# EAGLE design mikroPAD (EAGLE 6.5.0)
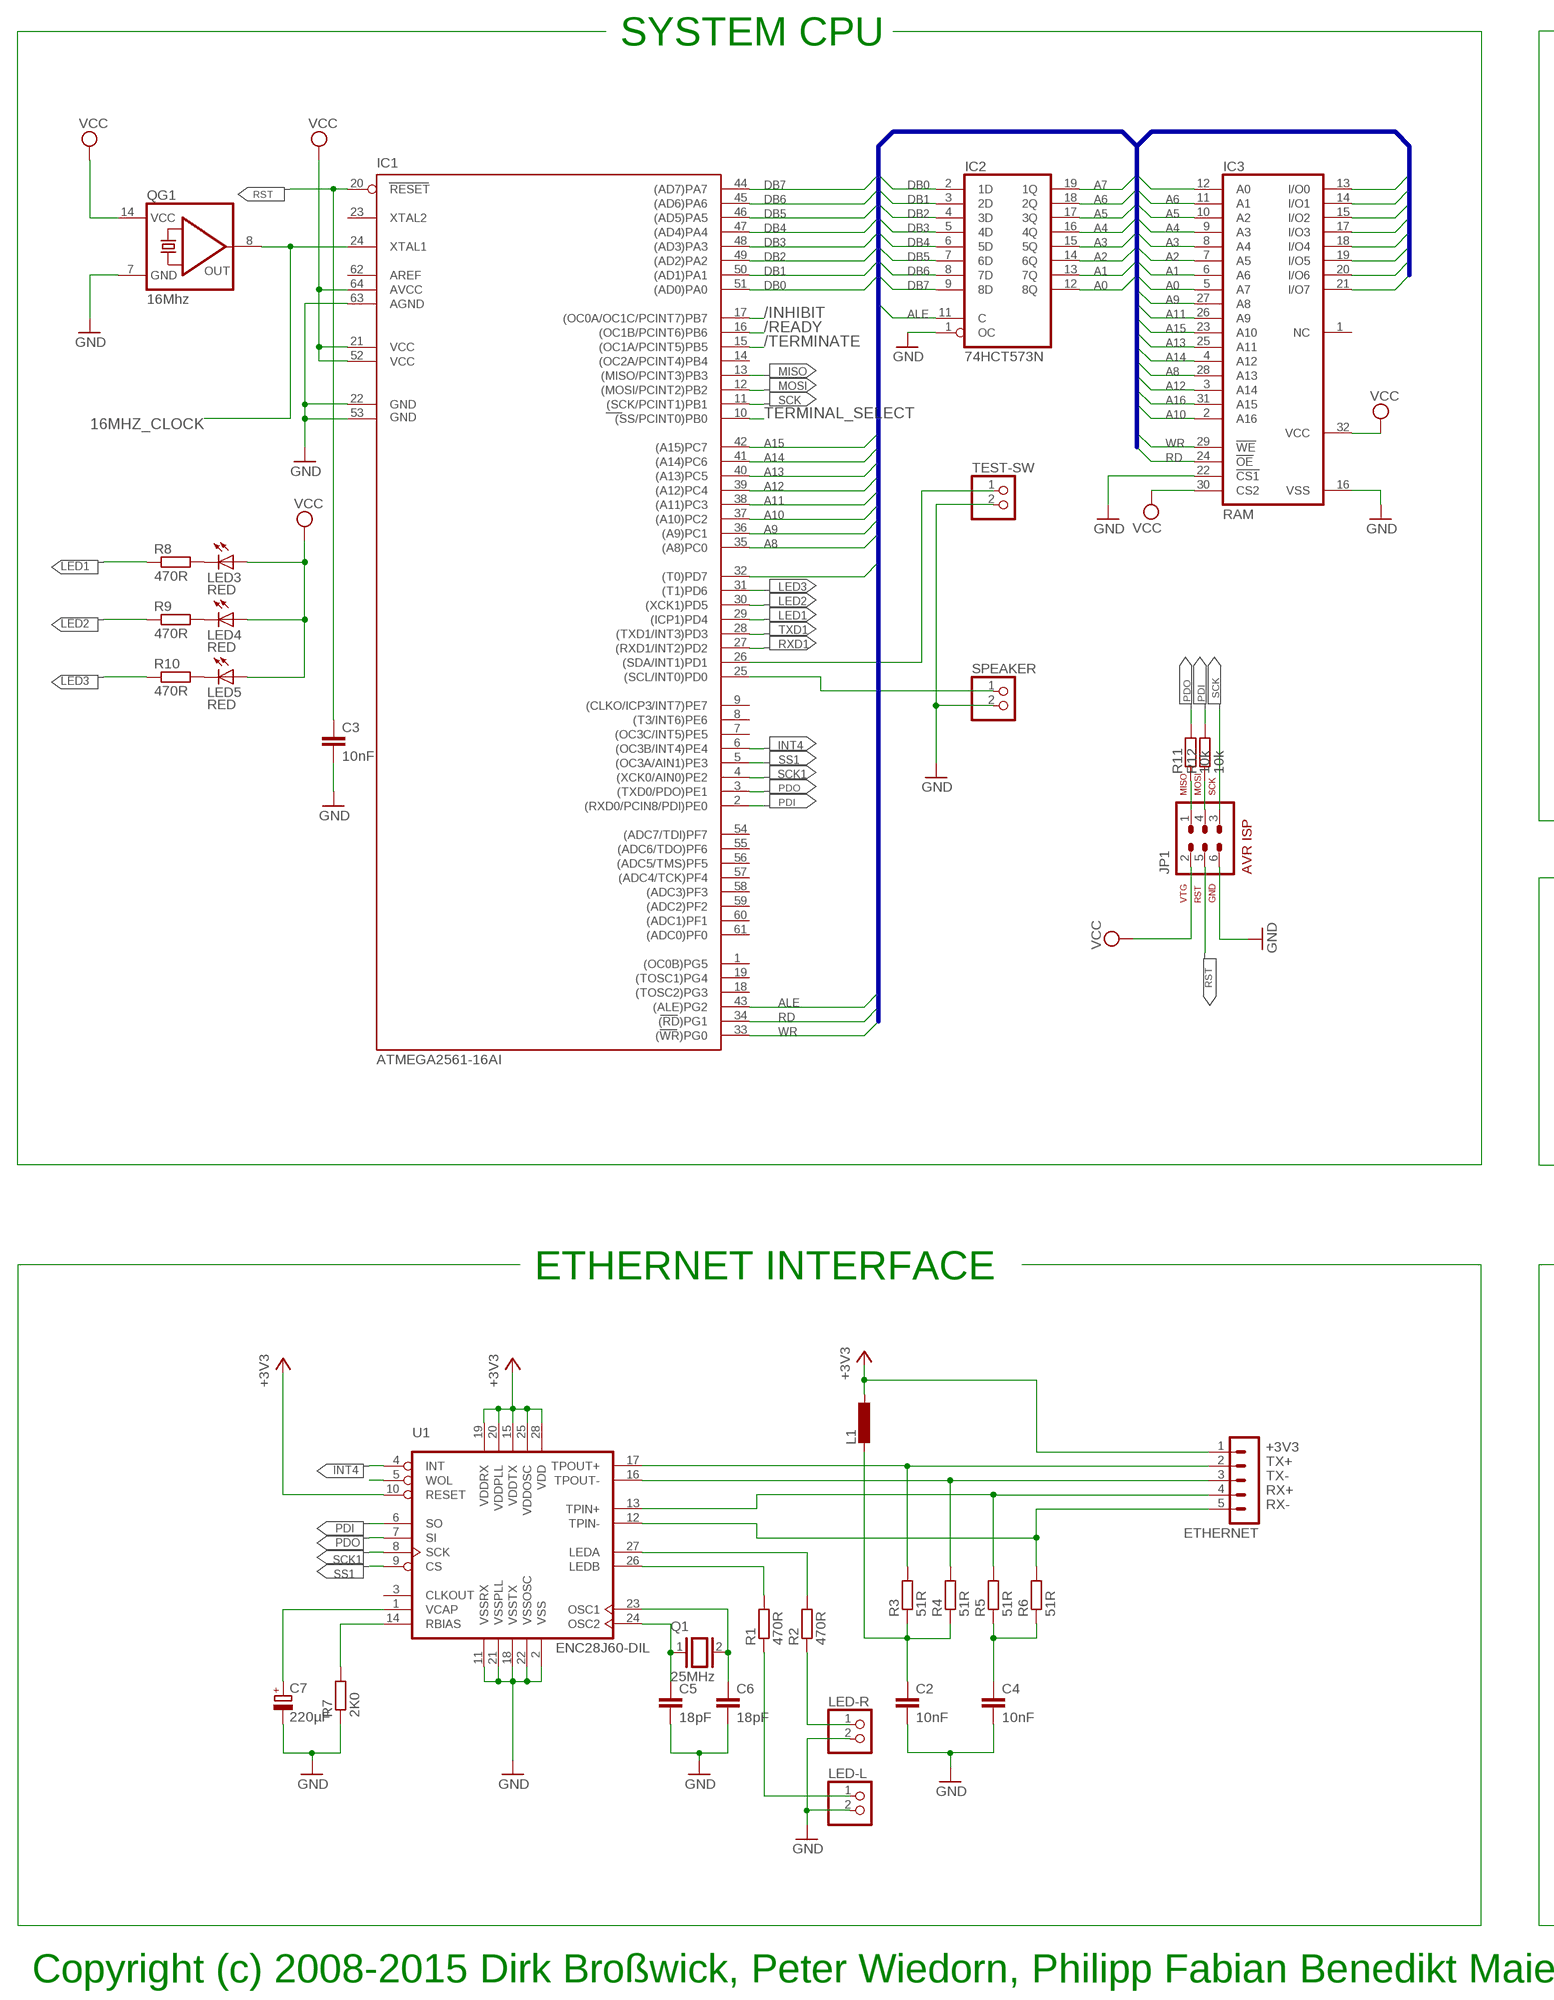
[diagram p0: schematic, sheet 1, part 1 of 2]
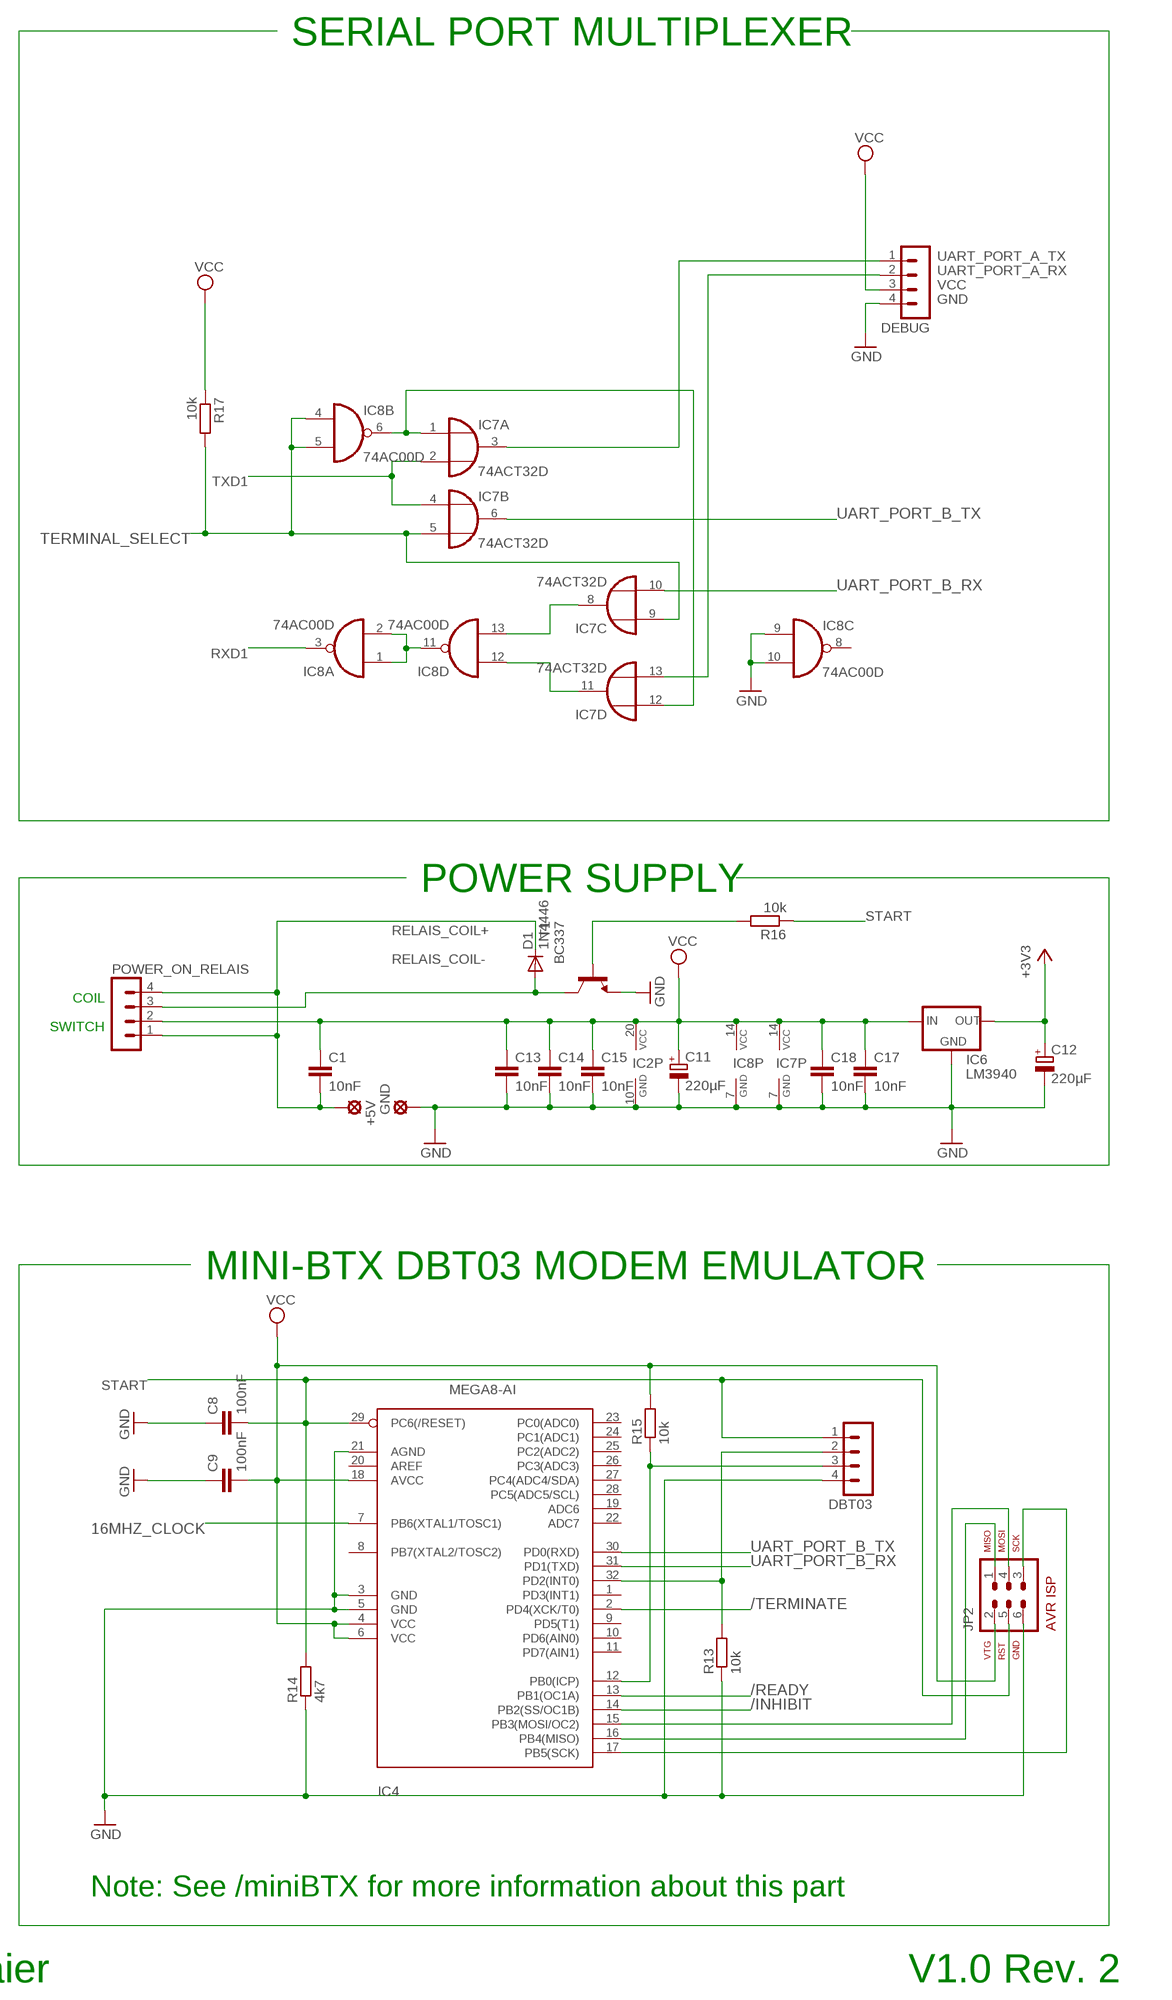
[diagram p1: schematic, sheet 1, part 2 of 2]

## Parts
+5V  SE14  [SE14]
C1  10nF  C-EU025-025X050  [C025-025X050]
C2  10nF  C-EU025-030X050  [C025-030X050]
C3  10nF  C-EU025-025X050  [C025-025X050]
C4  10nF  C-EU025-030X050  [C025-030X050]
C5  18pF  C-EU025-025X050  [C025-025X050]
C6  18pF  C-EU025-025X050  [C025-025X050]
C7  220µF  CPOL-EUE2-5  [E2-5]
C8  100nF  C-EU025-025X050  [C025-025X050]
C9  100nF  C-EU025-025X050  [C025-025X050]
C11  220µF  CPOL-EUE2.5-7  [E2,5-7]
C12  220µF  CPOL-EUE2.5-7  [E2,5-7]
C13  10nF  C-EU025-025X050  [C025-025X050]
C14  10nF  C-EU025-025X050  [C025-025X050]
C15  10nF  C-EU025-025X050  [C025-025X050]
C17  10nF  C-EU025-025X050  [C025-025X050]
C18  10nF  C-EU025-025X050  [C025-025X050]
D1  1N4446  [DO35-10]
DBT03  MA04-1  [MA04-1]
DEBUG  MA04-1  [MA04-1]
ETHERNET  MA05-1  [MA05-1]
GND  SE14  [SE14]
IC1  ATMEGA2561-16AI  ATMEGA1281-16AI  [TQFP64]
IC2  74HCT573N  [DIL20]
IC3  RAM  628128P  [DIL32]
IC4  MEGA8-AI  [TQFP32-08]
IC6  LM3940  78XXS  [78XXS]
IC7  74ACT32D  [SO14]
IC8  74AC00D  [SO14]
JP1  AVR-ISP-6  [AVR-ISP-6]
JP2  AVR-ISP-6  [AVR-ISP-6]
L1  L-EU0207/10  [0207/10]
LED3  RED  LED3MM  [LED3MM]
LED4  RED  LED3MM  [LED3MM]
LED5  RED  LED3MM  [LED3MM]
LED-L  PINHD-1X2  [1X02]
LED-R  PINHD-1X2  [1X02]
POWER_ON_RELAIS  MA04-1  [MA04-1]
Q1  25MHz  XTAL/S  [QS]
QG1  16Mhz  QG5860  [DIL14S]
R1  470R  R-EU_0207/10  [0207/10]
R2  470R  R-EU_0207/10  [0207/10]
R3  51R  R-EU_0207/10  [0207/10]
R4  51R  R-EU_0207/10  [0207/10]
R5  51R  R-EU_0207/10  [0207/10]
R6  51R  R-EU_0207/10  [0207/10]
R7  2K0  R-EU_0207/10  [0207/10]
R8  470R  R-EU_0207/10  [0207/10]
R9  470R  R-EU_0207/10  [0207/10]
R10  470R  R-EU_0207/10  [0207/10]
R11  10k  R-EU_0204/5  [0204/5]
R12  10k  R-EU_0204/5  [0204/5]
R13  10k  R-EU_0204/5  [0204/5]
R14  4k7  R-EU_0204/5  [0204/5]
R15  10k  R-EU_0204/5  [0204/5]
R16  10k  R-EU_0207/12  [0207/12]
R17  10k  R-EU_0204/7  [0204/7]
SPEAKER  PINHD-1X2  [1X02]
T1  BC337  [TO92]
TEST-SW  PINHD-1X2  [1X02]
U1  ENC28J60-DIL  [DIL28-3]

## Nets
16MHZ_CLOCK: IC1.24(XTAL1) IC4.7(PB6(XTAL1/TOSC1)) QG1.8(OUT)
+3V3 [power]: C12.+ ETHERNET.1 IC6.OUT L1.1 U1.10(RESET) U1.15(VDDTX) U1.19(VDDRX) U1.20(VDDPLL) U1.25(VDDOSC) U1.28(VDD)
/INHIBIT: IC1.17((OC0A/OC1C/PCINT7)PB7) IC4.14(PB2(SS/OC1B))
/READY: IC1.16((OC1B/PCINT6)PB6) IC4.13(PB1(OC1A))
/TERMINATE: IC1.15((OC1A/PCINT5)PB5) IC4.2(PD4(XCK/T0))
A0: IC2.12(8Q) IC3.5(A7)
A1: IC2.13(7Q) IC3.6(A6)
A2: IC2.14(6Q) IC3.7(A5)
A3: IC2.15(5Q) IC3.8(A4)
A4: IC2.16(4Q) IC3.9(A3)
A5: IC2.17(3Q) IC3.10(A2)
A6: IC2.18(2Q) IC3.11(A1)
A7: IC2.19(1Q) IC3.12(A0)
A8: IC1.35((A8)PC0) IC3.28(A13)
A9: IC1.36((A9)PC1) IC3.27(A8)
A10: IC1.37((A10)PC2) IC3.2(A16)
A11: IC1.38((A11)PC3) IC3.26(A9)
A12: IC1.39((A12)PC4) IC3.3(A14)
A13: IC1.40((A13)PC5) IC3.25(A11)
A14: IC1.41((A14)PC6) IC3.4(A12)
A15: IC1.42((A15)PC7) IC3.23(A10)
A16: IC1.32((T0)PD7) IC3.31(A15)
ALE: IC1.43((ALE)PG2) IC2.11(C)
DB0: IC1.51((AD0)PA0) IC2.2(1D) IC3.15(I/O2)
DB1: IC1.50((AD1)PA1) IC2.3(2D) IC3.14(I/O1)
DB2: IC1.49((AD2)PA2) IC2.4(3D) IC3.13(I/O0)
DB3: IC1.48((AD3)PA3) IC2.5(4D) IC3.17(I/O3)
DB4: IC1.47((AD4)PA4) IC2.6(5D) IC3.18(I/O4)
DB5: IC1.46((AD5)PA5) IC2.7(6D) IC3.19(I/O5)
DB6: IC1.45((AD6)PA6) IC2.8(7D) IC3.20(I/O6)
DB7: IC1.44((AD7)PA7) IC2.9(8D) IC3.21(I/O7)
DBT03_RX: DBT03.2 IC4.32(PD2(INT0)) R13.2
DBT03_TX: DBT03.3 IC4.12(PB0(ICP)) R15.1
GND [power]: C2.2 C3.2 C4.2 C5.2 C6.2 C7.- C8.1 C9.1 C11.- C12.- C13.2 C14.2 C15.2 C17.2 C18.2 DBT03.4 DEBUG.4 GND.MP IC1.22(GND) IC1.53(GND1) IC1.63(AGND) IC2.1(OC) IC2.10(GND) IC3.16(VSS) IC3.22(!CS1) IC4.3(GND) IC4.5(GND) IC4.21(AGND) IC6.GND IC7.7(P:GND) IC8.7(P:GND) IC8.9(C:I0) IC8.10(C:I1) JP1.6 JP2.6 LED-L.2 LED-R.2 QG1.7(GND) R7.1 R13.1 R14.1 SPEAKER.2 T1.1(E) TEST-SW.2 U1.2(VSS) U1.11(VSSRX) U1.18(VSSTX) U1.21(VSSPLL) U1.22(VSSOSC)
INT4: IC1.6((OC3B/INT4)PE4) U1.4(INT)
LED1: IC1.29((ICP1)PD4) R8.1
LED2: IC1.30((XCK1)PD5) R9.1
LED3: IC1.31((T1)PD6) R10.1
LEDA: R2.2 U1.27(LEDA)
LEDA_: LED-R.1 R2.1
LEDB: R1.2 U1.26(LEDB)
LEDB_: LED-L.1 R1.1
MISO: IC1.13((MISO/PCINT3)PB3)
MOSI: IC1.12((MOSI/PCINT2)PB2)
N$2: LED3.K(C) R8.2
N$3: LED4.K(C) R9.2
N$4: LED5.K(C) R10.2
N$8: R16.2 T1.2(B)
N$11: C5.1 Q1.1 U1.24(OSC2)
N$12: C4.1 R5.1 R6.1
N$13: C2.1 L1.2 R3.1 R4.1
N$14: C6.1 Q1.2 U1.23(OSC1)
N$17: R7.2 U1.14(RBIAS)
N$18: C7.+ U1.1(VCAP)
N$31: IC8.1(A:I0) IC8.2(A:I1) IC8.11(D:O)
N$32: JP1.1 R11.1
N$33: JP1.4 R12.1
N$35: IC7.8(C:O) IC8.13(D:I1)
N$38: IC7.1(A:I0) IC7.12(D:I0) IC8.6(B:O)
N$39: IC7.11(D:O) IC8.12(D:I0)
N$44: IC4.17(PB5(SCK)) JP2.3
N$45: IC4.15(PB3(MOSI/OC2)) JP2.4
N$46: IC4.16(PB4(MISO)) JP2.1
OC2A: IC1.26((SDA/INT1)PD1) TEST-SW.1
PDI: IC1.2((RXD0/PCIN8/PDI)PE0) R12.2 U1.6(SO)
PDO: IC1.3((TXD0/PDO)PE1) R11.2 U1.7(SI)
RD: IC1.34((RD)PG1) IC3.24(!OE)
RELAIS_COIL+: +5V.MP C1.2 D1.C POWER_ON_RELAIS.1 POWER_ON_RELAIS.4
RELAIS_COIL-: D1.A POWER_ON_RELAIS.3 T1.3(C)
RST: C3.1 IC1.20(RESET) JP1.5
RX+: ETHERNET.4 R5.2 U1.13(TPIN+)
RX-: ETHERNET.5 R6.2 U1.12(TPIN-)
RXD1: IC1.27((RXD1/INT2)PD2) IC8.3(A:O)
SCK: IC1.11((SCK/PCINT1)PB1) JP1.3
SCK1: IC1.4((XCK0/AIN0)PE2) U1.8(SCK)
SPEAKER: IC1.25((SCL/INT0)PD0) SPEAKER.1
SS1: IC1.5((OC3A/AIN1)PE3) U1.9(CS)
START: C8.2 DBT03.1 IC4.29(PC6(/RESET)) JP2.5 R14.2 R16.1
TERMINAL_SELECT: IC1.10((SS/PCINT0)PB0) IC7.5(B:I1) IC7.9(C:I0) IC8.4(B:I0) IC8.5(B:I1) R17.2
TX+: ETHERNET.2 R3.2 U1.17(TPOUT+)
TX-: ETHERNET.3 R4.2 U1.16(TPOUT-)
TXD1: IC1.28((TXD1/INT3)PD3) IC7.2(A:I1) IC7.4(B:I0)
UART_PORT_A_RX: DEBUG.2 IC7.13(D:I1)
UART_PORT_A_TX: DEBUG.1 IC7.3(A:O)
UART_PORT_B_RX: IC4.31(PD1(TXD)) IC7.10(C:I1)
UART_PORT_B_TX: IC4.30(PD0(RXD)) IC7.6(B:O)
VCC [power]: C1.1 C9.2 C11.+ C13.1 C14.1 C15.1 C17.1 C18.1 DEBUG.3 IC1.21(VCC) IC1.52(VCC1) IC1.64(AVCC) IC2.20(VCC) IC3.30(CS2) IC3.32(VCC) IC4.4(VCC) IC4.6(VCC) IC4.18(AVCC) IC6.IN IC7.14(P:VCC) IC8.14(P:VCC) JP1.2 JP2.2 LED3.A LED4.A LED5.A POWER_ON_RELAIS.2 QG1.14(VCC) R15.2 R17.1
WOL: U1.5(WOL)
WR: IC1.33((WR)PG0) IC3.29(!WE)
Unconnected: IC1.1((OC0B)PG5) IC1.7((OC3C/INT5)PE5) IC1.8((T3/INT6)PE6) IC1.9((CLKO/ICP3/INT7)PE7) IC1.14((OC2A/PCINT4)PB4) IC1.18((TOSC2)PG3) IC1.19((TOSC1)PG4) IC1.23(XTAL2) IC1.54((ADC7/TDI)PF7) IC1.55((ADC6/TDO)PF6) IC1.56((ADC5/TMS)PF5) IC1.57((ADC4/TCK)PF4) IC1.58((ADC3)PF3) IC1.59((ADC2)PF2) IC1.60((ADC1)PF1) IC1.61((ADC0)PF0) IC1.62(AREF) IC3.1(NC) IC4.1(PD3(INT1)) IC4.8(PB7(XTAL2/TOSC2)) IC4.9(PD5(T1)) IC4.10(PD6(AIN0)) IC4.11(PD7(AIN1)) IC4.19(ADC6) IC4.20(AREF) IC4.22(ADC7) IC4.23(PC0(ADC0)) IC4.24(PC1(ADC1)) IC4.25(PC2(ADC2)) IC4.26(PC3(ADC3)) IC4.27(PC4(ADC4/SDA)) IC4.28(PC5(ADC5/SCL)) IC8.8(C:O) U1.3(CLKOUT)

## Buses
DB[0..7],A[0..16],ALE,RD,WR

## Notes on the sheet
- SYSTEM CPU | SERIAL PORT MULTIPLEXER
- POWER SUPPLY
- COIL
- SWITCH
- ETHERNET INTERFACE | MINI-BTX DBT03 MODEM EMULATOR
- Note: See /miniBTX for more information about this part
- Copyright (c) 2008-2015 Dirk Broßwick, Peter Wiedorn, Philipp Fabian Benedikt Maier | V1.0 Rev. 2

## Library data of the parts
+5V GND = solpad:SE14: SOLDER PAD E1553, drill 1,4mm, distributor Buerklin, 07F820
C1-C6 C8 C9 C13-C15 C17 C18 = rcl:C-EU: CAPACITOR, European symbol
C7 C11 C12 = rcl:CPOL-EU: POLARIZED CAPACITOR, European symbol
D1 = diode:1N4446: DIODE high speed (Philips)
DBT03 DEBUG POWER_ON_RELAIS = con-lstb:MA04-1: PIN HEADER
ETHERNET = con-lstb:MA05-1: PIN HEADER
IC1 = atmel-2005:ATMEGA1281*: MICROCONTROLLER 128 Kbytes FLASH 4 Kbytes EEPROM 8 Kbytes SRAM 54 General Purpose I/O pins 6-channels 16-bit PWM 2 x Serial USARTs 8-channels 10-bit A/D
IC2 = 74xx-eu:74*573: 8-bit D latch BUS DRIVER
IC3 = memory-hitachi:628128P: MEMORY
IC4 = atmel:MEGA8: MICROCONTROLLER 8 Kbytes FLASH, 1 kbytes SRAM, 512 bytes EEPROM, USART, 6-channel 10 bit ADC, 2-channel 8 bit ADC Pin compatible with Atmega48, ATMega88, ATMega168 Source: avr.lbr
IC6 = v-reg:78XXS: VOLTAGE REGULATOR
IC7 = 74xx-eu:74*32: Quad 2-input OR gate
IC8 = 74xx-eu:74*00: Quad 2-input NAND gate
JP1 JP2 = atmel-1:AVR-ISP-6: AVR ISP-6 Serial Programming Header
L1 = rcl:L-EU: INDUCTOR, European symbol
LED3-LED5 = led:LED: LED OSRAM: - CHIPLED LG R971, LG N971, LY N971, LG Q971, LY Q971, LO R971, LY R971 LH N974, LH R974 LS Q976, LO Q976, LY Q976 LO Q996 - Hyper CHIPLED LW Q18S LB Q993, LB Q99A, LB R99A - SideLED LS A670, LO A670, LY A670, LG A670, LP A670 LB A673, LV A673, LT A673, LW A673 LH A674 LY A675 LS A676, LA A676, LO A676, LY A676, LW A676 LS A679, LY A679, LG A679 - Hyper Micro SIDELED® LS Y876, LA Y876, LO Y876, LY Y876 LT Y87S - SmartLED LW L88C, LW L88S LB L89C, LB L89S, LG L890 LS L89K, LO L89K, LY L89K LS L896, LA L896, LO L896, LY L896 - TOPLED LS T670, LO T670, LY T670, LG T670, LP T670 LSG T670, LSP T670, LSY T670, LOP T670, LYG T670 LG T671, LOG T671, LSG T671 LB T673, LV T673, LT T673, LW T673 LH T674 LS T676, LA T676, LO T676, LY T676, LB T676, LH T676, LSB T676, LW T676 LB T67C, LV T67C, LT T67C, LS T67K, LO T67K, LY T67K, LW E67C LS E67B, LA E67B, LO E67B, LY E67B, LB E67C, LV E67C, LT E67C LW T67C LS T679, LY T679, LG T679 LS T770, LO T770, LY T770, LG T770, LP T770 LB T773, LV T773, LT T773, LW T773 LH T774 LS E675, LA E675, LY E675, LS T675 LS T776, LA T776, LO T776, LY T776, LB T776 LHGB T686 LT T68C, LB T68C - Hyper Mini TOPLED® LB M676 - Mini TOPLED Santana® LG M470 LS M47K, LO M47K, LY M47K Source: http://www.osram.convergy.de LUXEON: - LUMILED® LXK2-PW12-R00, LXK2-PW12-S00, LXK2-PW14-U00, LXK2-PW14-V00 LXK2-PM12-R00, LXK2-PM12-S00, LXK2-PM14-U00 LXK2-PE12-Q00, LXK2-PE12-R00, LXK2-PE12-S00, LXK2-PE14-T00, LXK2-PE14-U00 LXK2-PB12-K00, LXK2-PB12-L00, LXK2-PB12-M00, LXK2-PB14-N00, LXK2-PB14-P00, LXK2-PB14-Q00 LXK2-PR12-L00, LXK2-PR12-M00, LXK2-PR14-Q00, LXK2-PR14-R00 LXK2-PD12-Q00, LXK2-PD12-R00, LXK2-PD12-S00 LXK2-PH12-R00, LXK2-PH12-S00 LXK2-PL12-P00, LXK2-PL12-Q00, LXK2-PL12-R00 Source: www.luxeon.com KINGBRIGHT: KA-3528ASYC Source: www.kingbright.com
LED-L LED-R SPEAKER TEST-SW = pinhead:PINHD-1X2: PIN HEADER
Q1 = special:XTAL/S: CRYSTAL
QG1 = crystal:QG5860: CRYSTAL RESONATOR
R1-R17 = rcl:R-EU_: RESISTOR, European symbol
T1 = transistor:BC337: NPN TRANSISTOR
U1 = microchip-enc28j60:ENC28J60-*: Microchip 10Mbit Eth. contoller with SPI interface

## Net classes
0 default: width 0.203 mm
1 power: width 0.356 mm

## Board
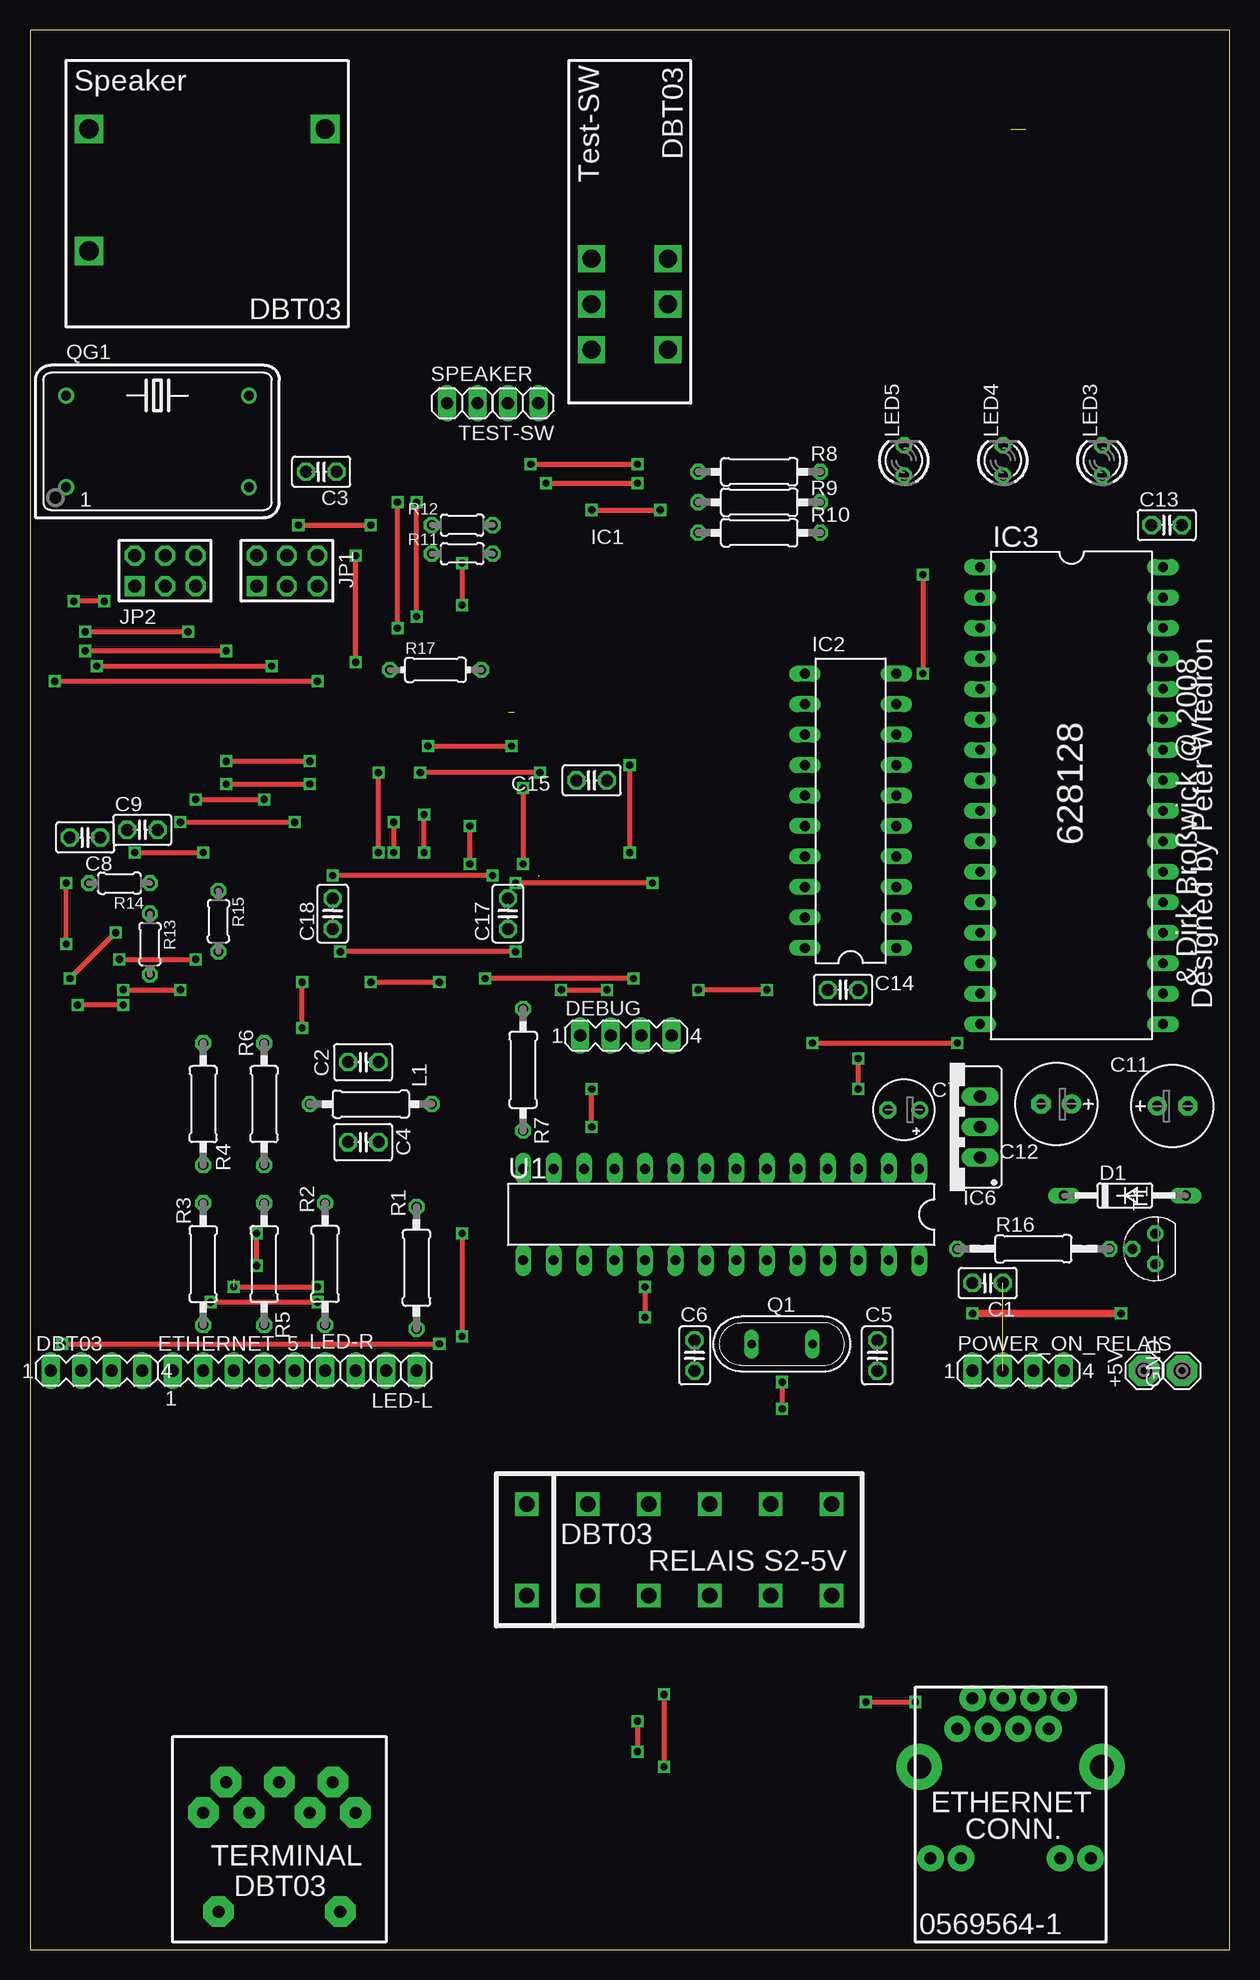
[diagram p2: board, top side]
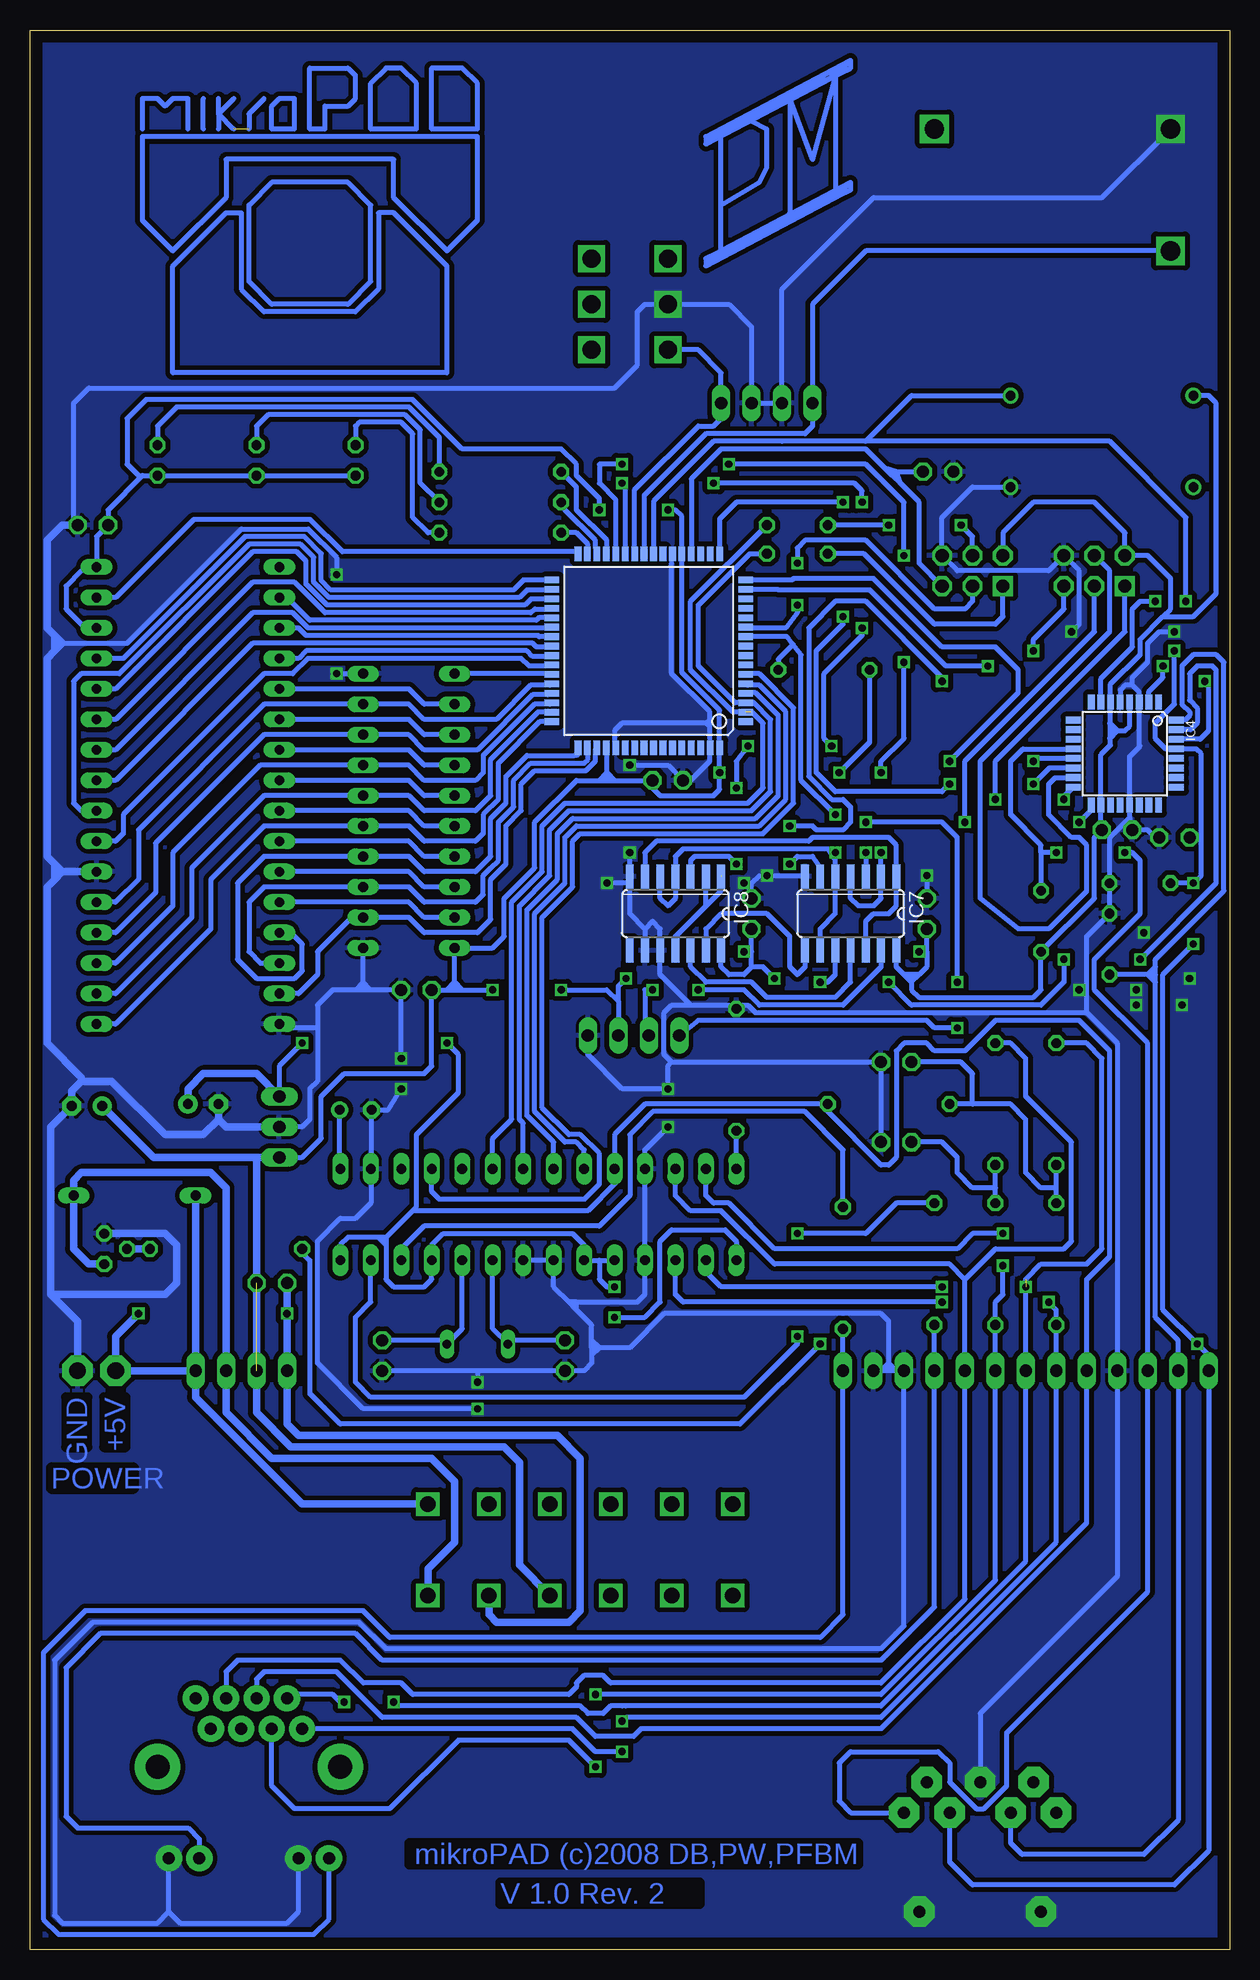
[diagram p3: board, bottom side, seen from below]

Size 100 x 160.01 mm. Coordinates in mm from the lower left corner, seen from the top.
Outline: 0,0 100,0 100,160.01 0,160.01 0,0
Copper layers (1*16): Top 0.035mm / dielectric 1.5mm / Bottom 0.035mm
Design rules "default": minimum track width 10mil, minimum drill 24mil, track to track 8mil, track to pad 8mil, pad to pad 8mil, via to via 8mil, smd to smd 8mil, copper to edge 40mil, drill to drill 8mil, minimum pad ring 10mil, minimum via ring 8mil, stop-mask expansion 4mil, vias tented up to drill 0mil, thermal gap 10mil

### Footprints (pad centres in the part's own frame; a part is rotated, then mirrored left to right if it is on the bottom)
SE14 = drill 1.397 pad 2.54 octagon: MP 0,0
C025-025X050 = drill 1 octagon: 1 -1.27,0; 2 1.27,0
C025-030X050 = drill 1 octagon: 1 -1.27,0; 2 1.27,0
E2-5 = drill 0.813 pad 1.422: + -1.333,0 | drill 0.813 pad 1.422 octagon: - 1.333,0
E2,5-7 = drill 0.813 pad 1.6: + -1.27,0 | drill 0.813 pad 1.6 octagon: - 1.27,0
DO35-10 = drill 0.813 long: A 5.08,0; C -5.08,0
MA04-1 = drill 1.016 long: 1 -3.81,0; 2 -1.27,0; 3 1.27,0; 4 3.81,0
MA05-1 = drill 1.016 long: 1 -5.08,0; 2 -2.54,0; 3 0,0; 4 2.54,0; 5 5.08,0
TQFP64 = smd 1.194 x 0.559: 1 -8.077,5.905; 2 -8.077,5.118; 3 -8.077,4.331; 4 -8.077,3.543; 5 -8.077,2.756; 6 -8.077,1.968; 7 -8.077,1.181; 8 -8.077,0.394; 9 -8.077,-0.394; 10 -8.077,-1.181; 11 -8.077,-1.968; 12 -8.077,-2.756; 13 -8.077,-3.543; 14 -8.077,-4.331; 15 -8.077,-5.118; 16 -8.077,-5.905; 33 8.077,-5.905; 34 8.077,-5.118; 35 8.077,-4.331; 36 8.077,-3.543; 37 8.077,-2.756; 38 8.077,-1.968; 39 8.077,-1.181; 40 8.077,-0.394; 41 8.077,0.394; 42 8.077,1.181; 43 8.077,1.968; 44 8.077,2.756; 45 8.077,3.543; 46 8.077,4.331; 47 8.077,5.118; 48 8.077,5.905 | smd 0.559 x 1.194: 17 -5.905,-8.077; 18 -5.118,-8.077; 19 -4.331,-8.077; 20 -3.543,-8.077; 21 -2.756,-8.077; 22 -1.968,-8.077; 23 -1.181,-8.077; 24 -0.394,-8.077; 25 0.394,-8.077; 26 1.181,-8.077; 27 1.968,-8.077; 28 2.756,-8.077; 29 3.543,-8.077; 30 4.331,-8.077; 31 5.118,-8.077; 32 5.905,-8.077; 49 5.905,8.077; 50 5.118,8.077; 51 4.331,8.077; 52 3.543,8.077; 53 2.756,8.077; 54 1.968,8.077; 55 1.181,8.077; 56 0.394,8.077; 57 -0.394,8.077; 58 -1.181,8.077; 59 -1.968,8.077; 60 -2.756,8.077; 61 -3.543,8.077; 62 -4.331,8.077; 63 -5.118,8.077; 64 -5.905,8.077
DIL20 = drill 0.813 long: 1 -11.43,-3.81; 2 -8.89,-3.81; 3 -6.35,-3.81; 4 -3.81,-3.81; 5 -1.27,-3.81; 6 1.27,-3.81; 7 3.81,-3.81; 8 6.35,-3.81; 9 8.89,-3.81; 10 11.43,-3.81; 11 11.43,3.81; 12 8.89,3.81; 13 6.35,3.81; 14 3.81,3.81; 15 1.27,3.81; 16 -1.27,3.81; 17 -3.81,3.81; 18 -6.35,3.81; 19 -8.89,3.81; 20 -11.43,3.81
DIL32 = drill 0.813 long: 1 -19.05,-7.62; 2 -16.51,-7.62; 3 -13.97,-7.62; 4 -11.43,-7.62; 5 -8.89,-7.62; 6 -6.35,-7.62; 7 -3.81,-7.62; 8 -1.27,-7.62; 9 1.27,-7.62; 10 3.81,-7.62; 11 6.35,-7.62; 12 8.89,-7.62; 13 11.43,-7.62; 14 13.97,-7.62; 15 16.51,-7.62; 16 19.05,-7.62; 17 19.05,7.62; 18 16.51,7.62; 19 13.97,7.62; 20 11.43,7.62; 21 8.89,7.62; 22 6.35,7.62; 23 3.81,7.62; 24 1.27,7.62; 25 -1.27,7.62; 26 -3.81,7.62; 27 -6.35,7.62; 28 -8.89,7.62; 29 -11.43,7.62; 30 -13.97,7.62; 31 -16.51,7.62; 32 -19.05,7.62
TQFP32-08 = smd 1.27 x 0.559: 1 -4.293,2.8; 2 -4.293,2; 3 -4.293,1.2; 4 -4.293,0.4; 5 -4.293,-0.4; 6 -4.293,-1.2; 7 -4.293,-2; 8 -4.293,-2.8; 17 4.293,-2.8; 18 4.293,-2; 19 4.293,-1.2; 20 4.293,-0.4; 21 4.293,0.4; 22 4.293,1.2; 23 4.293,2; 24 4.293,2.8 | smd 0.559 x 1.27: 9 -2.8,-4.293; 10 -2,-4.293; 11 -1.2,-4.293; 12 -0.4,-4.293; 13 0.4,-4.293; 14 1.2,-4.293; 15 2,-4.293; 16 2.8,-4.293; 25 2.8,4.293; 26 2,4.293; 27 1.2,4.293; 28 0.4,4.293; 29 -0.4,4.293; 30 -1.2,4.293; 31 -2,4.293; 32 -2.8,4.293
78XXS = drill 1.016 long: GND 0,-2.54; IN -2.54,-2.54; OUT 2.54,-2.54
SO14 = smd 0.66 x 2.032: 1 -3.81,-3.073; 2 -2.54,-3.073; 3 -1.27,-3.073; 4 0,-3.073; 5 1.27,-3.073; 6 2.54,-3.073; 7 3.81,-3.073; 8 3.81,3.073; 9 2.54,3.073; 10 1.27,3.073; 11 0,3.073; 12 -1.27,3.073; 13 -2.54,3.073; 14 -3.81,3.073
AVR-ISP-6 = drill 1.1 square: 1 -2.54,-1.27 | drill 1.1 octagon: 2 -2.54,1.27; 3 0,-1.27; 4 0,1.27; 5 2.54,-1.27; 6 2.54,1.27
0207/10 = drill 0.813 octagon: 1 -5.08,0; 2 5.08,0
LED3MM = drill 0.813 octagon: A -1.27,0; K 1.27,0
1X02 = drill 1.016 long: 1 -1.27,0; 2 1.27,0
QS = drill 0.7 long: 1 -2.54,0; 2 2.54,0
DIL14S = drill 0.813: 1 -7.62,-3.81; 7 7.62,-3.81; 8 7.62,3.81; 14 -7.62,3.81
0204/5 = drill 0.813 octagon: 1 -2.54,0; 2 2.54,0
0207/12 = drill 0.813 octagon: 1 -6.35,0; 2 6.35,0
0204/7 = drill 0.813 octagon: 1 -3.81,0; 2 3.81,0
TO92 = drill 0.813 octagon: 1 1.27,0; 2 0,1.905; 3 -1.27,0
DIL28-3 = drill 0.813 long: 1 -16.51,-3.81; 2 -13.97,-3.81; 3 -11.43,-3.81; 4 -8.89,-3.81; 5 -6.35,-3.81; 6 -3.81,-3.81; 7 -1.27,-3.81; 8 1.27,-3.81; 9 3.81,-3.81; 10 6.35,-3.81; 11 8.89,-3.81; 12 11.43,-3.81; 13 13.97,-3.81; 14 16.51,-3.81; 15 16.51,3.81; 16 13.97,3.81; 17 11.43,3.81; 18 8.89,3.81; 19 6.35,3.81; 20 3.81,3.81; 21 1.27,3.81; 22 -1.27,3.81; 23 -3.81,3.81; 24 -6.35,3.81; 25 -8.89,3.81; 26 -11.43,3.81; 27 -13.97,3.81; 28 -16.51,3.81

### Placement (x,y rotation side)
+5V  92.86,48.26 90 top
C1  79.84,55.56 180 top
C2  27.77,73.97 0 top
C3  24.28,123.19 180 top
C4  27.77,67.31 0 top
C5  70.64,49.53 270 top
C6  55.4,49.53 270 top
C7  72.86,70 180 top
C8  4.6,92.71 180 top
C9  9.36,93.34 0 top
C11  95.24,70.32 0 top
C12  85.56,70.48 180 top
C13  94.77,118.74 0 top
C14  67.78,80 0 top
C15  46.82,97.47 180 top
C17  39.84,86.36 90 top
C18  25.23,86.36 90 top
D1  91.28,62.86 0 top
DBT03  5.55,48.26 0 top
DEBUG  49.68,76.2 0 top
ETHERNET  16.98,48.26 0 top
GND  96.04,48.26 90 top
IC1  48.41,108.26 180 bottom
IC2  68.41,94.93 90 top
IC3  86.83,96.2 270 top
IC4  8.73,99.69 270 bottom
IC6  76.67,68.58 90 top
IC7  31.58,86.36 180 bottom
IC8  46.19,86.36 180 bottom
JP1  21.42,114.93 0 top
JP2  11.27,114.93 0 top
L1  28.41,70.48 180 top
LED3  89.37,124.14 90 top
LED4  81.11,124.14 90 top
LED5  72.86,124.14 90 top
LED-L  30.95,48.26 180 top
LED-R  25.87,48.26 0 top
POWER_ON_RELAIS  82.39,48.26 0 top
Q1  62.7,50.48 180 top
QG1  10.63,125.72 0 top
R1  32.22,56.83 90 top
R2  24.6,57.15 90 top
R3  14.44,57.15 270 top
R4  14.44,70.48 90 top
R5  19.52,57.15 270 top
R6  19.52,70.48 90 top
R7  41.11,73.34 270 top
R8  60.8,123.19 0 top
R9  60.8,120.65 0 top
R10  60.8,118.1 0 top
R11  36.03,116.36 0 top
R12  36.03,118.74 0 top
R13  10,83.81 270 top
R14  7.46,88.9 180 top
R15  15.71,85.72 270 top
R16  83.66,58.42 0 top
R17  33.81,106.68 0 top
SPEAKER  36.03,128.9 0 top
T1  93.81,58.42 90 top
TEST-SW  41.11,128.9 180 top
U1  57.62,61.27 180 top

### Tracks (layer width: path | path; a pad name or v marks a point on that pad's centre or on a via)
16MHZ_CLOCK  (via drill 0.6)
  Top 0.406: v6.18,112.39 v3.64,112.39
  Bottom 0.406: QG1.8 26.5,129.53 30.31,125.72 | 30.31,125.72 37.3,125.72 43.02,125.72 48.02,120.72 IC1.24 | 30.31,125.72 10,125.72 3.64,119.38 v3.64,112.39 | IC4.7 10.73,105.94 8.09,108.58 8.09,111.75 7.46,112.39 v6.18,112.39
+3V3  (via drill 0.6, 1 pad 2.18)
  Top 0.406: v51.27,55.24 v51.27,52.7 | v65.24,75.56 v77.3,75.56
  Bottom 0.406: U1.15 41.11,59.05 42.06,60 46.51,60 47.46,59.05 47.46,53.97 48.73,52.7 v51.27,52.7 | 52.54,57.46 U1.20 53.81,58.73 54.76,59.69 65.56,59.69 66.51,58.73 U1.25 66.51,55.88 67.14,55.24 69.69,55.24 70.32,55.88 70.32,58.73 | 52.54,57.46 U1.19 | 70.32,59.37 70.95,59.37 | 70.95,59.37 73.5,59.37 74.13,58.73 U1.28 | 70.32,59.37 70.32,58.73 | 68.1,61.59 53.49,61.59 51.27,63.81 U1.10 51.27,67.94 48.73,70.48 L1.1 33.49,69.84 29.04,65.4 28.41,65.4 27.77,66.03 27.77,74.93 27.14,75.56 25.23,75.56 24.6,74.93 22.06,74.93 19.52,77.47 12.54,77.47 10,74.93 10,57.78 11.9,55.88 ETHERNET.1 11.9,35.56 29.04,18.41 49.05,18.41 49.68,17.78 52.86,17.78 54.45,19.36 70.64,19.36 74.45,23.17 80.48,23.17 81.11,22.54 v81.11,20.95 | 68.1,61.59 70.32,59.37 | 70.95,59.37 70.32,58.73 | v51.27,55.24 51.91,55.24 52.54,55.88 52.54,57.46 | IC6.OUT 79.21,73.66 v77.3,75.56 | v65.24,75.56 64.29,74.61 64.29,71.43 67.78,67.94 67.78,61.91 68.1,61.59
  Bottom 0.61: C12.+ 86.83,71.75 85.56,73.02 81.11,73.02 IC6.OUT
/INHIBIT  (via drill 0.6)
  Top 0.406: v16.34,97.15 v23.33,97.15 | v32.22,111.12 v32.22,120.65
  Bottom 0.406: IC1.17 42.51,119.25 41.11,120.65 v32.22,120.65 | IC4.14 15.01,98.49 v16.34,97.15 | v32.22,111.12 32.22,110.48 34.44,108.26 34.44,98.1 32.85,96.52 23.96,96.52 v23.33,97.15
/READY  (via drill 0.6)
  Top 0.406: v16.34,99.06 v23.33,99.06
  Bottom 0.406: IC4.13 16.11,99.29 v16.34,99.06 | v23.33,99.06 17.61,104.77 17.61,106.68 19.52,108.58 23.96,108.58 29.68,114.3 36.35,114.3 36.48,114.17 IC1.16
/TERMINATE  (via drill 0.6)
  Top 0.406: v5.55,106.99 v20.15,106.99
  Bottom 0.406: IC4.2 6.72,104.87 5.55,106.04 v5.55,106.99 | v20.15,106.99 23.65,106.99 30,113.34 37.62,113.34 37.66,113.38 IC1.15
A0
  Bottom 0.406: IC2.12 67.14,103.82 68.41,105.09 IC3.5
A1
  Bottom 0.406: IC2.13 67.14,101.28 68.41,102.55 IC3.6
A2
  Bottom 0.406: IC2.14 67.14,98.74 68.41,100.01 IC3.7
A3
  Bottom 0.406: IC2.15 67.14,96.2 68.41,97.47 IC3.8
A4
  Bottom 0.406: IC2.16 67.14,93.66 68.41,94.93 IC3.9
A5
  Bottom 0.406: IC2.17 67.14,91.12 68.41,92.39 IC3.10
A6
  Bottom 0.406: IC2.18 67.14,88.58 68.41,89.85 IC3.11
A7
  Bottom 0.406: IC2.19 67.14,86.04 68.41,87.31 IC3.12
A8
  Bottom 0.254: 76.35,113.18
  Bottom 0.406: IC3.28 92.86,105.09 81.43,116.52 77.76,116.52 76.99,115.75 76.99,113.82 76.35,113.18 75.24,112.07 58.73,112.07 58.21,112.59 IC1.35
A9
  Bottom 0.254: 56.67,111.75 IC1.36
  Bottom 0.406: IC3.27 92.86,102.55 81.43,113.98 77.94,113.98 75.4,111.44 58.25,111.44 57.94,111.75 56.67,111.75
A10
  Bottom 0.406: IC3.2 78.58,112.71 76.67,110.8 57.78,110.8 57.56,111.02 IC1.37
A11
  Bottom 0.254: IC1.38 56.67,110.17
  Bottom 0.406: 56.67,110.17 76.83,110.17 78.1,111.44 81.43,111.44 92.86,100.01 IC3.26
A12
  Bottom 0.406: IC3.3 77.62,110.17 76.99,109.53 57.62,109.53 arc-90 57.53,109.44 IC1.39
A13
  Bottom 0.254: IC1.40 56.67,108.58
  Bottom 0.406: 56.67,108.58 57.78,108.58 58.1,108.9 81.43,108.9 92.86,97.47 IC3.25
A14
  Bottom 0.254: IC1.41 56.51,107.79
  Bottom 0.406: IC3.4 77.62,107.63 76.99,108.26 58.57,108.26 58.1,107.79 56.51,107.79
A15
  Bottom 0.254: IC1.42 56.67,106.99
  Bottom 0.406: IC3.23 92.86,92.39 92.23,93.02 92.23,94.61 80.48,106.36 78.1,106.36 76.83,107.63 59.05,107.63 58.41,106.99 56.67,106.99
A16
  Bottom 0.254: IC1.32 54.45,116.52
  Bottom 0.406: 54.45,116.52 73.95,116.52 76.65,119.22 86.35,119.22 92.86,112.71 IC3.31
ALE
  Bottom 0.254: IC1.43 56.67,106.36
  Bottom 0.406: 56.67,106.36 IC2.11
DB0
  Bottom 0.254: 52.86,100.01 IC1.51 | 62.22,85.24
  Bottom 0.406: 52.86,100.01 52.86,99.06 53.65,98.26 57.94,98.26 59.05,97.15 59.05,94.93 60.32,93.66 60.32,90.48 61.59,89.21 61.59,85.88 62.22,85.24 62.7,84.77 67.14,84.77 68.41,86.04 IC2.2 73.18,86.04 76.03,83.18 76.03,81.28 77.62,79.69 IC3.15
DB1
  Bottom 0.254: 53.49,100.01 IC1.50 | 62.86,87.31 | 61.59,90.16
  Bottom 0.406: 53.49,100.01 53.49,99.21 53.81,98.9 58.25,98.9 59.68,97.47 59.68,95.25 60.95,93.97 60.95,90.8 61.59,90.16 62.22,89.53 62.22,87.94 62.86,87.31 67.14,87.31 68.41,88.58 IC2.3 80.48,88.58 81.75,87.31 81.75,83.18 80.8,82.23 IC3.14
DB2
  Bottom 0.254: 62.22,90.48 | 60.95,94.93 | 58.57,99.53 54.6,99.53 | 54.6,99.53 | 54.6,99.53 54.45,99.53
  Bottom 0.406: 62.22,90.48 61.59,91.12 61.59,94.29 60.95,94.93 | 54.6,99.53 58.57,99.53 60.32,97.78 60.32,95.56 60.95,94.93 | 62.22,90.48 62.86,89.85 67.14,89.85 68.41,91.12 IC2.4 80.48,91.12 82.7,88.9 82.7,82.55 81.11,80.96 77.94,80.96 77.3,81.59 77.3,83.81 78.26,84.77 IC3.13 | 54.45,99.53 54.29,99.69 IC1.49
DB3
  Bottom 0.254: 56.52,102.39 IC1.48
  Bottom 0.406: 56.52,102.39 57.46,102.39 60.95,98.9 60.95,95.88 62.22,94.61 62.22,93.02 62.86,92.39 67.14,92.39 68.41,93.66 IC2.5 80.48,93.66 84.92,89.21 84.92,85.09 92.86,77.15 IC3.17
DB4
  Bottom 0.254: 56.67,103.18 IC1.47 | 62.22,95.56
  Bottom 0.406: 56.67,103.18 57.62,103.18 61.59,99.21 61.59,96.2 62.22,95.56 62.86,94.93 67.14,94.93 68.41,96.2 IC2.6 80.48,96.2 86.51,90.16 86.51,86.04 92.86,79.69 IC3.18
DB5
  Bottom 0.254: IC1.46 56.67,103.82
  Bottom 0.406: 56.67,103.82 57.94,103.82 62.22,99.53 62.22,98.1 62.86,97.47 67.14,97.47 68.41,98.74 IC2.7 80.8,98.74 88.1,91.44 88.1,86.99 92.86,82.23 IC3.19
DB6
  Bottom 0.254: IC1.45 56.83,104.61
  Bottom 0.406: 56.83,104.61 58.1,104.61 62.7,100.01 67.14,100.01 68.41,101.28 IC2.8 80.48,101.28 89.53,92.23 89.53,88.1 92.86,84.77 IC3.20
DB7
  Bottom 0.254: IC1.44 56.67,105.41
  Bottom 0.406: 56.67,105.41 58.25,105.41 61.11,102.55 67.14,102.55 68.41,103.82 IC2.9 80.48,103.82 90.96,93.34 90.96,89.21 92.86,87.31 IC3.21
DBT03_RX  (via drill 1 pad 2.54)
  Bottom 0.406: 6.18,80.64 6.18,52.7 4.28,50.8 DBT03.2 4.28,10.79 7.14,7.93 17.3,7.93 18.25,8.89 v18.25,11.43 | 6.18,80.64 6.18,81.28 | 6.18,81.28 6.18,81.91 | 6.18,81.91 6.18,82.55 0.47,88.26 0.47,107.31 1.1,107.94 3.01,107.94 3.96,106.99 3.96,103.82 3.33,103.18 3.33,102.87 3.7,102.49 IC4.32 | 6.18,81.28 6.82,81.28 | 6.82,81.28 R13.2 | 6.82,81.28 6.18,81.91 | 6.18,80.64 6.82,81.28
DBT03_TX  (via drill 0.6, 1 pad 2.54)
  Top 0.406: v8.73,91.44 v14.44,91.44
  Bottom 0.406: 15.71,91.44 15.71,92.07 18.25,94.61 18.25,99.06 17.21,100.09 IC4.12 | 15.71,91.44 R15.1 | v8.73,91.44 8.09,91.44 7.46,90.8 7.46,86.36 11.27,82.55 11.27,80 6.82,75.56 DBT03.3 6.82,29.84 18.57,18.09 18.57,13.65 20.47,11.74 21.11,11.74 23.33,13.97 23.33,15.55 24.28,16.51 31.58,16.51 32.54,15.55 32.54,12.38 31.58,11.43 v27.14,11.43 | v14.44,91.44 15.71,91.44
GND  (via drill 0.6, 1 pad 2.18, 1 pad 2.54, 1.5, 1.6)
  Top 0.406: v46.82,68.58 v46.82,71.75 | v4.6,109.85 v13.17,109.85 | v38.57,89.53 v25.23,89.53 | v69.05,71.75 v69.05,74.29 | v62.7,47.3 v62.7,45.08 | v50,91.44 v50,98.74 | v74.45,114.61 v74.45,106.36 | v51.91,88.9 v40.48,88.9 | v7.77,78.73 v3.96,78.73 | v7.77,80 v12.54,80 | v7.14,84.77 v3.33,80.96
  Bottom 0.356: IC1.63 43.33,100.96 | 46.51,115.56 IC1.22 | 43.33,102.23 43.33,101.91 43.65,102.23 43.33,102.55 | 51.27,100.64 IC1.53
  Bottom 0.406: 46.51,115.56 46.51,106.36 43.33,103.18 43.33,102.55 43.33,102.23 43.65,102.23 50.63,102.23 51.27,101.59 51.27,100.64 | 43.33,100.96 43.33,101.91 | U1.22 U1.21 56.35,55.24 55.08,53.97 | 97.31,108.9 91.91,108.9 82.39,118.42 76.8,118.42 74.45,116.06 v74.45,114.61 | IC1.63 43.33,100.15 43.33,99.06 44.92,97.47 C15.2 46.82,98.74 v50,98.74 | C4.2 C2.2 46.51,73.97 | 28.41,48.26 29.04,48.26 | 29.04,48.26 LED-L.2 | 62.7,48.26 C6.2 53.81,48.26 53.17,48.89 53.17,49.53 | 62.7,48.26 C5.2 | 54.45,53.34 55.08,53.97 | 54.45,53.34 53.17,52.07 53.17,50.8 | 53.17,50.16 53.17,50.8 | 53.17,50.16 53.17,49.53 | 71.59,80 C14.2 v69.05,74.29 | 71.59,80 72.22,80 | 72.22,80 72.22,80.64 | 72.22,80.64 IC2.1 | 71.53,65.15 C7.- 70.16,70 v69.05,71.75 | 71.53,65.15 U1.2 | 11.9,78.1 9.36,75.56 DBT03.4 9.36,31.11 20.79,19.68 v20.79,13.97 | 7.52,100.25 8.33,99.46 IC4.21 8.33,94.38 | 7.52,100.25 7.46,100.33 | 7.52,100.25 IC4.3 7.52,104.84 8.09,105.41 | 11.9,78.1 11.9,84.45 R13.1 R14.1 10,92.71 8.33,94.38 | 11.9,78.1 39.52,78.1 40.16,78.73 40.79,78.73 R7.1 41.43,78.42 41.74,78.73 44.92,78.73 | v46.82,68.58 48.73,66.67 U1.11 U1.18 48.73,54.61 49.37,53.97 54.45,53.97 | 54.45,53.97 55.08,53.97 | 54.45,53.34 54.45,53.97 | IC4.5 9.12,105 8.73,105.41 8.09,105.41 | v13.17,109.85 12.54,110.48 12.54,114.93 JP2.6 15.08,114.93 22.7,114.93 JP1.6 23.96,119.38 21.42,121.91 QG1.7 | 8.09,105.41 8.09,106.04 6.82,107.31 6.82,108.9 5.87,109.85 v4.6,109.85 | 48.73,85.09 50,86.36 50,88.9 | 50,88.9 IC8.7 v50,91.44 | 48.73,85.09 IC8.9 | 48.73,85.09 48.09,85.72 47.46,85.09 IC8.10 47.46,81.28 44.92,78.73 | IC7.7 35.5,89.53 v38.57,89.53 39.2,89.53 39.84,88.9 C17.2 39.84,88.26 v40.48,88.9
  Bottom 0.406: v4.92,151.76 10.63,146.05 29.68,146.05 37.3,138.43 SPEAKER.2 TEST-SW.2 39.84,135.25 41.74,137.16 v46.82,137.16 48.73,137.16 49.37,136.52 49.37,132.07 51.27,130.17 95.08,130.17 96.36,128.9 96.36,118.74 | v25.23,89.53 C18.2 | DEBUG.4 53.49,74.61 50.63,71.75 v46.82,71.75 46.82,73.66 46.51,73.97 | 72.22,80 72.86,80 | 72.86,80 74.77,80 76.03,78.73 76.03,76.83 | 76.03,76.83 78.89,76.83 IC3.16 | IC6.GND 77.3,68.58 76.67,69.21 76.67,71.75 76.03,72.39 76.03,76.83 | 71.53,65.15 71.53,62.29 72.86,60.95 74.13,60.95 76.03,59.05 76.03,48.89 72.22,45.08 v62.7,45.08 | 62.7,48.26 v62.7,47.3 | 44.92,78.73 46.51,78.73 47.14,78.1 47.14,74.61 46.51,73.97 | v74.45,106.36 IC2.10 | 27.77,48.26 28.41,48.26 | 27.77,48.26 LED-R.2 27.14,26.98 29.04,25.08 70.32,25.08 72.54,27.3 94.77,27.3 97.94,24.13 97.94,2.85 97.31,2.22 89.37,2.22 88.42,3.17 | 28.41,48.89 28.41,52.38 29.04,53.02 47.14,53.02 50,50.16 52.54,50.16 | 28.41,48.26 28.41,48.89 | 52.54,50.16 53.17,50.16 | 52.54,50.16 53.17,50.8 | 52.54,50.16 53.17,49.53 | 27.77,48.26 28.41,48.89 | 28.41,48.89 29.04,48.26 | 88.42,3.17 v88.42,7.62 | 88.42,3.17 87.47,2.22 78.58,2.22 77.62,3.17 v77.62,7.62 | 50,88.9 v51.91,88.9 | 71.59,80 72.22,80.64 | 72.22,80.64 72.86,80 | C8.1 6.18,92.71 6.82,93.34 C9.1 8.33,93.58 8.33,94.38
  Bottom 0.61: 97.31,89.85 97.94,90.48 | 97.94,90.48 98.58,91.12 98.58,107.63 97.94,108.26 | 97.94,108.26 97.31,108.9 97.94,109.53 | 97.94,89.21 98.58,88.58 98.58,75.56 95.72,72.7 95.72,72.39 | 97.94,89.21 97.31,89.85 | 97.31,89.85 IC3.22 | C13.2 96.36,118.74 97.31,118.74 98.58,117.47 98.58,110.17 97.94,109.53 | 97.94,89.21 97.94,90.48 | 97.94,108.26 97.94,109.53 | IC6.GND 83.66,68.58 84.29,69.21 | 95.72,72.39 96.51,71.59 C11.- 98.26,68.58 98.26,54.61 | 95.72,72.39 93.18,72.39 88.73,67.94 85.56,67.94 84.29,69.21 | 84.29,69.21 C12.- | GND.MP 96.04,52.38 98.26,54.61 | T1.1 88.73,59.69 87.78,58.73 87.78,55.56 88.73,54.61 98.26,54.61
  other vias: 15.71,3.17 25.87,3.17
  pour Bottom (isolate 0.406): 0.47,160.02 99.53,160.02 99.53,0 0.47,0
INT4
  Bottom 0.254: 40.16,106.36 IC1.6
  Bottom 0.406: 40.16,106.36 39.2,106.36 36.35,103.5 36.35,95.56 38.89,93.02 54.13,93.02 54.76,92.39 54.76,88.58 57.3,86.04 57.3,70.16 55.08,67.94 54.13,67.94 52.54,66.35 52.54,63.81 53.81,62.54 65.88,62.54 66.51,63.18 U1.4
LED1
  Bottom 0.254: IC1.29 51.91,116.84
  Bottom 0.406: 51.91,116.84 51.91,117.47 54.45,120.01 54.45,121.91 R8.1
LED2
  Bottom 0.254: IC1.30 52.86,116.84
  Bottom 0.406: 52.86,116.84 52.86,117.47 55.4,120.01 R9.1
LED3
  Bottom 0.254: IC1.31 53.49,116.84
  Bottom 0.406: 53.49,116.84 53.49,117.15 54.45,118.1 R10.1
LEDA  (via drill 0.6)
  Top 0.406: v36.03,59.69 v36.03,51.11
  Bottom 0.406: U1.27 71.59,53.97 72.86,52.7 72.86,47.3 71.59,46.03 40.48,46.03 38.89,47.62 36.03,50.48 v36.03,51.11 | R2.2 27.77,62.23 30.31,59.69 v36.03,59.69
LEDA_  (via drill 1 pad 2.18)
  Bottom 0.406: R2.1 LED-R.1 24.6,28.57 29.04,24.13 50.32,24.13 | 50.32,24.13 50.63,24.13 | 50.32,24.13 70.64,24.13 72.86,26.35 94.13,26.35 96.99,23.49 96.99,11.11 96.04,10.16 86.83,10.16 85.88,9.2 v85.88,7.62
LEDB
  Bottom 0.406: U1.26 69.05,58.42 67.14,60.32 52.54,60.32 50,62.86 50,67.94 48.09,69.84 35.39,69.84 32.22,66.67 R1.2
LEDB_  (via drill 1 pad 2.18)
  Bottom 0.406: R1.1 LED-L.1 32.22,27.94 34.12,26.03 70,26.03 72.22,28.25 95.4,28.25 98.89,24.76 98.89,2.54 97.62,1.27 76.35,1.27 75.08,2.54 v75.08,7.62
N$1
  Top 0.406: 70,20.63 73.5,20.63 73.81,20.32
N$2
  Bottom 0.406: R8.2 65.88,126.04 68.41,128.58 87.78,128.58 89.37,127 LED3.K
N$3
  Bottom 0.406: R9.2 67.46,122.23 67.46,126.68 68.73,127.95 80.16,127.95 81.11,127 LED4.K
N$4
  Bottom 0.406: R10.2 66.83,118.1 68.1,119.38 68.1,126.36 69.05,127.31 72.54,127.31 72.86,127 LED5.K
N$5  (via drill 1 pad 2.18)
  Bottom 0.406: 73.81,20.32 74.77,21.27 78.26,21.27 v78.58,20.95
N$6  (via drill 1.3)
  other vias: 41.43,29.52
N$7  (via drill 0.6)
  other vias: 73.81,20.63
N$8
  Bottom 0.61: R16.2 T1.2
N$9  (via drill 1.3)
  other vias: 46.51,29.52
N$10  (via drill 1.3)
  other vias: 51.59,29.52
N$11
  Bottom 0.406: U1.24 63.97,51.75 Q1.1 65.56,50.8 C5.1
N$12
  Bottom 0.406: R5.1 19.52,63.5 | 19.52,63.5 R6.1 | C4.1 23.96,67.31 22.7,66.03 22.7,64.77 21.42,63.5 19.52,63.5
N$13
  Bottom 0.406: R3.1 14.44,63.5 | 14.44,63.5 R4.1 | 21.42,70.48 18.25,70.48 16.98,69.21 16.98,64.77 15.71,63.5 14.44,63.5 | 21.42,70.48 L1.2 | C2.1 22.38,73.97 21.42,73.02 21.42,70.48
N$14
  Bottom 0.406: U1.23 61.43,51.75 Q1.2 | C6.1 59.84,50.8
  Bottom 0.61: 59.84,50.8 Q1.2
N$15  (via drill 0.6)
  other vias: 69.69,20.63
N$16
  pour Bottom (isolate 0.406): -0.17,160.02 100.16,160.02 100.16,0 -0.17,0
N$17
  Bottom 0.406: U1.14 R7.2
N$18
  Bottom 0.406: C7.+ 74.19,65.15 U1.1
N$19
  Bottom 0.406: 65.24,131.44 88.1,131.44 88.1,140.33 83.66,144.78 82.39,144.78 82.39,138.43 80.48,136.52 72.86,136.52 70.95,138.43 70.95,144.78 69.69,144.78 65.24,140.33 65.24,131.44
N$20  (via drill 1.3)
  other vias: 41.43,37.14
N$21  (via drill 1.3)
  other vias: 46.51,37.14
N$22  (via drill 1.3)
  other vias: 51.59,37.14
N$23  (via drill 1.3)
  other vias: 56.67,37.14
N$24  (via drill 1.3)
  other vias: 61.75,37.14
N$25
  Bottom 0.406: 71.59,139.06 73.5,137.16 79.84,137.16 81.75,139.06 81.75,145.41 79.84,147.31 73.5,147.31 71.59,145.41 71.59,139.06
N$26
  Bottom 0.406: 65.24,141.6 69.69,146.05 69.69,149.22 83.66,149.22 83.66,146.05 88.1,141.6 90.64,144.14 90.64,151.12 62.7,151.12 62.7,144.14 65.24,141.6
N$27
  Bottom 0.406: 86.83,151.76 86.83,154.3 88.1,154.3 88.73,153.66 89.37,154.3 90.64,154.3 90.64,151.76
N$29  (via drill 1 pad 2.18)
  other vias: 86.19,20.95
N$31  (1 unrouted)
  Bottom 0.406: IC8.11 46.19,84.45 44.28,86.36 | 44.28,86.36 43.65,86.99 IC8.2 | 42.38,89.53 42.38,88.26 44.28,86.36
N$32
  Bottom 0.406: R11.1 30.47,116.36 24.6,110.48 19.52,110.48 18.88,111.12 JP1.1
N$33  (via drill 0.6)
  Top 0.406: v22.38,118.74 v28.41,118.74
  Bottom 0.406: JP1.4 21.42,117.79 v22.38,118.74 | v28.41,118.74 R12.1
N$35
  Bottom 0.406: IC7.8 35.39,81.91 36.03,81.28 36.66,81.91 36.66,84.45 38.57,86.36 42.38,86.36 43.65,85.09 IC8.13
N$37  (via drill 1 pad 2.18)
  other vias: 84.92,18.41
N$38
  Bottom 0.406: IC7.12 30.31,85.72 29.68,86.36 28.41,86.36 27.77,86.99 IC7.1 27.77,92.07 28.41,92.71 34.76,92.71 35.08,92.39 47.78,92.39 48.73,91.44 IC8.6
N$39
  Bottom 0.406: IC7.11 31.58,80.64 32.85,79.37 38.57,79.37 39.84,80.64 43.65,80.64 44.92,81.91 IC8.12
N$43  (via drill 1 pad 2.18)
  other vias: 82.39,18.41
N$44  (via drill 0.6)
  Top 0.406: v12.54,93.97 v22.06,93.97
  Bottom 0.406: IC4.17 11.53,94.98 v12.54,93.97 | JP2.3 11.27,109.85 22.06,99.06 v22.06,93.97
N$45
  Bottom 0.406: JP2.4 10,114.93 10,109.85 20.79,99.06 20.79,87.62 17.61,85.09 15.08,85.09 11.9,88.26 11.9,92.07 12.54,92.71 13.17,92.71 15.08,94.61 15.08,97.15 14.54,97.69 IC4.15
N$46  (via drill 0.6)
  Top 0.406: v13.81,95.88 v19.52,95.88
  Bottom 0.406: JP2.1 8.73,109.85 19.52,99.06 v19.52,95.88 | v13.81,95.88 13.81,96.1 IC4.16
N$47
  Bottom 0.406: 31.58,147.31 43.65,140.97 | 31.58,146.68 43.65,140.33 | 43.65,140.97 43.65,140.33 | 43.65,140.97 31.58,146.68 | 31.58,147.31 31.58,146.68 | 31.58,147.31 43.65,140.33 | 32.54,146.36 31.58,147.31 | 32.54,146.36 32.85,146.05 43.65,140.97 | 43.65,140.97 41.74,141.6 43.65,140.33 | 43.65,151.12 31.58,157.47 | 31.58,156.84 43.65,150.49 | 31.58,157.47 31.58,156.84 | 43.65,151.12 31.58,156.84 | 43.65,151.12 43.65,150.49 | 31.58,157.47 43.65,150.49 | 36.66,144.78 36.66,154.3 34.76,149.22 32.85,156.21 | 32.85,156.21 32.85,146.68 | 32.85,156.21 32.54,156.52 | 31.58,157.47 32.54,156.52 | 43.65,151.12 32.85,156.21 | 39.84,152.4 38.57,151.76 38.57,148.59 39.2,147.31 42.38,145.41 | 42.38,145.41 42.38,141.6 43.65,140.33 | 42.38,145.41 42.38,151.12 43.65,151.12 | 43.65,150.49 42.38,151.76 | 43.65,150.49 41.74,151.76 | 32.54,146.36 33.17,146.36 33.17,146.05 | 32.54,156.52 33.17,156.52 33.17,156.21
N$49  (via drill 1.5)
  other vias: 53.17,133.34
N$50  (via drill 1.5)
  other vias: 53.17,140.97
N$51  (via drill 1.5)
  other vias: 46.82,140.97
N$53  (via drill 1.5)
  other vias: 53.17,137.16
N$56  (via drill 1 pad 2.54)
  other vias: 14.44,11.43
N$58
  Bottom 0.406: 67.78,151.76 67.78,155.57 69.05,156.84 70.32,156.84 71.59,155.57 71.59,151.76 67.78,151.76
N$59
  Bottom 0.406: 62.7,151.76 66.51,151.76 66.51,156.84 63.97,156.84 62.7,155.57 62.7,151.76
N$60  (via drill 1 pad 2.54)
  other vias: 16.34,13.97
N$61
  Bottom 0.406: 85.56,151.76 85.56,154.3
N$62  (via drill 1 pad 2.54)
  other vias: 25.23,13.97
N$63  (1 unrouted)
  Bottom 0.406: 84.29,153.03 84.29,151.76 | 84.29,153.03 84.29,154.3 | 84.29,153.03 83.02,154.3 | 83.02,151.76 84.29,153.03 | 81.75,151.76 81.75,153.03 80.48,154.3
N$64  (via drill 1.6)
  other vias: 24.6,151.76
N$65
  Bottom 0.406: 79.84,151.76 79.84,153.66 79.21,154.3 77.94,154.3 77.94,151.76 79.84,151.76
N$66
  Bottom 0.406: 76.67,151.76 76.67,156.84 73.5,156.84 72.86,156.21 72.86,154.3 73.5,153.66 75.4,153.66 75.4,151.76 76.67,151.76
N$68  (via drill 2 pad 3.81)
  other vias: 89.37,15.23
N$69  (via drill 2 pad 3.81)
  other vias: 74.13,15.23
OC2A  (via drill 1.5)
  Bottom 0.406: IC1.26 49.59,121.69 44.28,127 43.02,127 42.38,127.63 TEST-SW.1 42.38,131.44 44.28,133.34 v46.82,133.34
PDI  (1 unrouted)
  Bottom 0.254: 39.84,103.18 39.88,103.14
  Bottom 0.406: 39.84,103.18 38.89,102.23 38.89,96.83 40.16,95.56 55.4,95.56 57.3,93.66 57.3,89.85 59.84,87.31 59.84,69.21 61.43,67.62 U1.6 | 39.88,103.14 41.39,103.14 44.92,106.68 44.92,112.39 R12.2
PDO
  Bottom 0.254: IC1.3 40.16,103.93 40.16,103.82
  Bottom 0.406: 40.16,103.93 39.64,103.93 38.25,102.55 38.25,96.52 39.84,94.93 55.08,94.93 56.67,93.34 56.67,89.53 59.21,86.99 59.21,69.21 58.89,68.89 U1.7 | IC1.3 41.22,103.93 44.28,106.99 44.28,112.07 40,116.36 R11.2
RD
  Bottom 0.254: IC1.34 56.67,113.34
  Bottom 0.406: IC3.24 95.72,94.93 96.36,95.56 96.36,105.72 95.72,106.36 92.55,106.36 81.75,117.15 77.44,117.15 76.35,116.06 76.35,113.98 75.08,112.71 59.21,112.71 58.57,113.34 56.67,113.34
RELAIS_COIL+  (via drill 0.6, 1.3)
  Top 0.61: v78.58,53.02 v90.96,53.02
  Bottom 0.61: POWER_ON_RELAIS.4 D1.C | POWER_ON_RELAIS.4 86.19,46.03 77.3,37.14 v66.83,37.14 | v90.96,53.02 92.86,51.11 +5V.MP POWER_ON_RELAIS.4 | 78.58,52.38 POWER_ON_RELAIS.1 78.58,43.81 77.62,42.86 56.03,42.86 54.13,40.95 54.13,28.25 55.08,27.3 61.11,27.3 61.75,27.94 v61.75,29.52 | 78.58,52.38 v78.58,53.02 | 78.58,52.38 C1.2
RELAIS_COIL-  (via drill 1.3)
  Bottom 0.61: T1.3 95.08,57.15 96.36,58.42 D1.A 96.36,64.13 95.72,64.77 84.92,64.77 83.66,63.5 POWER_ON_RELAIS.3 83.66,44.76 79.84,40.95 66.51,40.95 64.61,39.05 64.61,33.97 66.83,31.75 v66.83,29.52
RST
  Bottom 0.254: IC1.20 44.92,116.52
  Bottom 0.406: IC1.20 44.87,122.6 42.38,125.09 30.31,125.09 28.73,123.5 | JP1.5 25.87,115.56 25.87,120.65 27.46,122.23 | 27.46,122.23 28.09,122.87 | 28.09,122.87 28.73,123.5 | 27.77,123.19 28.09,123.19 28.09,122.87 | 27.77,123.19 C3.1 | 27.77,123.19 28.73,123.5 | 27.46,122.23 27.77,123.19
RX+  (via drill 0.6, 1 pad 2.18)
  Top 0.406: v18.88,57.01 v18.88,59.69 | v52.86,21.27 v52.86,15.23
  Bottom 0.406: U1.13 43.65,62.86 43.02,62.23 41.74,62.23 37.94,58.42 22.7,58.42 21.42,59.69 v18.88,59.69 | v18.88,57.01 18.88,54.61 19.52,53.97 R5.2 ETHERNET.4 19.52,30.79 29.04,21.27 v52.86,21.27 | v52.86,15.23 55.08,17.46 64.29,17.46 70,11.74 77.94,11.74 79.84,13.65 v79.84,18.41
RX-  (via drill 1 pad 2.18)
  Bottom 0.406: 22.06,55.88 ETHERNET.5 22.06,29.21 29.04,22.22 51.59,22.22 52.22,22.86 53.81,22.86 54.45,22.22 54.45,21.9 55.08,21.27 68.1,21.27 69.05,22.22 72.22,22.22 74.13,24.13 82.7,24.13 83.66,23.17 v83.66,20.95 | 22.06,55.88 23.33,57.15 37.94,57.15 42.38,61.59 44.92,61.59 46.19,62.86 U1.12 | R6.2 18.25,75.56 16.98,74.29 16.98,71.12 13.17,67.31 13.17,59.05 13.81,58.42 19.52,58.42 22.06,55.88
RXD1  (via drill 0.6)
  Top 0.406: v43.02,122.23 v50.63,122.23 | v30.63,110.17 v30.63,120.65 | v41.11,96.83 v41.11,90.48 | v33.17,100.33 v40.16,100.33
  Bottom 0.406: IC1.27 50.38,122.3 v50.63,122.23 | v30.63,120.65 30.63,121.6 31.27,122.23 v43.02,122.23 | v30.63,110.17 30.63,109.53 33.81,106.36 33.81,100.96 v33.17,100.33 | IC8.3 44.92,90.8 44.6,91.12 41.74,91.12 v41.11,90.48 | v41.11,96.83 41.11,99.06 v40.16,100.33
SCK  (via drill 0.6)
  Top 0.406: v36.03,115.56 v36.03,112.07
  Bottom 0.254: 40.16,110.17 IC1.11
  Bottom 0.406: 40.16,110.17 36.98,110.17 36.03,111.44 v36.03,112.07 | JP1.3 21.42,112.39 22.06,111.75 24.6,111.75 30.31,117.47 35.39,117.47 36.03,116.84 v36.03,115.56
SCK1
  Bottom 0.254: 40.16,104.77 IC1.4
  Bottom 0.406: 40.16,104.77 39.52,104.77 37.62,102.87 37.62,96.2 39.52,94.29 54.76,94.29 56.03,93.02 56.03,89.21 58.57,86.67 58.57,69.53 56.35,67.31 U1.8
SPEAKER  (via drill 1.6)
  Bottom 0.406: IC1.25 48.81,121.2 43.65,126.36 35.39,126.36 34.76,127 SPEAKER.1 34.76,137.16 30.31,141.6 v4.92,141.6
SS1
  Bottom 0.254: 40.16,105.41 | 40.16,105.41 IC1.5
  Bottom 0.406: 40.16,105.41 39.2,105.41 36.98,103.18 36.98,95.88 39.2,93.66 54.45,93.66 55.4,92.71 55.4,88.9 57.94,86.36 57.94,69.84 55.4,67.31 54.45,67.31 53.81,66.67 U1.9
START  (via drill 0.6, 1 pad 2.54)
  Top 0.406: v3.01,83.81 v3.01,88.9 | v4.6,108.26 v16.34,108.26 | v2.69,50.48 v34.12,50.48
  Bottom 0.406: 2.38,92.71 2.38,89.53 v3.01,88.9 R14.2 | 2.38,92.71 2.38,99.69 2.78,100.09 IC4.29 5.31,100.09 6.18,100.96 6.18,102.23 4.6,103.82 v4.6,108.26 | v3.01,83.81 5.55,81.28 5.55,53.34 v2.69,50.48 1.74,49.53 DBT03.1 1.74,8.25 4.6,5.39 21.42,5.39 23.33,7.3 v23.33,11.43 | JP2.5 13.81,111.75 16.34,109.22 v16.34,108.26 | R16.1 77.62,58.42 76.67,57.46 76.67,46.35 74.13,43.81 40.79,43.81 v34.12,50.48 | C8.2 2.38,92.71
TERMINAL_SELECT  (via drill 0.6)
  Top 0.406: v32.85,91.44 v32.85,94.61
  Bottom 0.406: IC7.9 34.12,85.09 32.85,86.36 IC7.5 32.85,90.16 | IC8.5 47.46,87.62 46.82,86.99 46.19,87.62 IC8.4 46.19,91.12 45.55,91.75 33.49,91.75 32.85,90.8 32.85,90.16 | IC1.10 36.89,109.44 36.39,108.8 | 36.39,108.8 35.71,107.94 35.71,97.47 v32.85,94.61 | 32.85,90.16 v32.85,91.44 | R17.2 37.62,107.57 36.39,108.8
TX+  (via drill 0.6, 1 pad 2.18)
  Top 0.406: v15.08,53.97 v23.96,53.97 | v50.63,19.05 v50.63,16.51
  Bottom 0.406: v15.08,53.97 14.44,53.34 R3.2 ETHERNET.2 14.44,33.97 29.04,19.36 50.32,19.36 v50.63,19.05 | U1.17 46.19,54.61 45.55,53.97 v23.96,53.97 | v50.63,16.51 52.86,16.51 54.76,18.41 v77.3,18.41
TX-  (via drill 0.6)  (1 unrouted)
  Top 0.406: v16.98,55.24 v23.96,55.24
  Bottom 0.406: R4.2 11.9,75.56 10.63,74.29 10.63,58.42 11.9,57.15 15.71,57.15 16.98,55.88 ETHERNET.3 16.98,32.38 29.04,20.32 50.32,20.32 | U1.16 43.65,56.51 42.38,55.24 v23.96,55.24 | 50.32,20.32 50.63,20.32 | 50.32,20.32 51.59,20.32 52.22,19.68 53.49,19.68 54.13,20.32 69.69,20.32 70,20.63
TXD1  (via drill 0.6)
  Top 0.406: v41.74,123.82 v50.63,123.82 | v27.14,107.31 v27.14,116.2 | v29.04,91.44 v29.04,98.1
  Bottom 0.406: IC7.4 31.58,87.62 30.95,86.99 29.68,86.99 29.04,87.62 IC7.2 v29.04,91.44 | IC1.28 51.17,120.86 52.54,122.23 52.54,123.82 v50.63,123.82 | v41.74,123.82 30.31,123.82 27.14,120.65 v27.14,116.2 | v27.14,107.31 27.14,100.96 29.04,99.06 v29.04,98.1
UART_PORT_A_RX  (via drill 0.6)
  Top 0.406: v44.28,80 v48.09,80
  Bottom 0.406: IC7.13 29.04,81.91 32.22,78.73 39.2,78.73 40.48,80 v44.28,80 | v48.09,80 48.73,80 48.73,76.51 DEBUG.2
UART_PORT_A_TX  (via drill 0.6)
  Top 0.406: v22.7,76.83 v22.7,80.64 | v30.31,93.97 v30.31,91.44
  Bottom 0.406: v22.7,80.64 22.7,92.71 23.96,93.97 v30.31,93.97 | v30.31,91.44 IC7.3 | v22.7,76.83 24.6,76.83 25.23,77.47 44.28,77.47 DEBUG.1
UART_PORT_B_RX  (via drill 0.6)
  Top 0.406: v7.46,82.55 v13.81,82.55 | v28.41,80.64 v34.12,80.64
  Bottom 0.406: v7.46,82.55 1.1,88.9 1.1,106.68 1.42,106.99 2.69,106.99 3.33,106.36 3.33,104.14 2.69,103.5 2.69,102.23 3.23,101.69 IC4.31 | v13.81,82.55 13.81,80.64 15.71,78.73 26.5,78.73 v28.41,80.64 | v34.12,80.64 33.49,80.64 32.85,81.28 IC7.10
UART_PORT_B_TX  (via drill 0.6)
  Top 0.406: v2.06,105.72 v23.96,105.72 | v36.66,93.66 v36.66,90.48
  Bottom 0.406: v2.06,105.72 1.74,105.41 1.74,101.59 2.45,100.89 IC4.30 | v23.96,105.72 23.96,106.04 30.31,112.39 32.85,112.39 35.08,110.17 35.08,97.78 33.17,95.88 32.22,95.88 31.58,95.25 31.58,93.97 32.22,93.34 34.44,93.34 34.76,93.66 v36.66,93.66 | IC7.6 34.12,90.16 34.76,91.12 36.03,91.12 v36.66,90.48
VCC  (via drill 0.6, 1.3)  (1 unrouted)
  Top 0.406: v46.82,120.01 v52.54,120.01 | v40.48,83.18 v25.87,83.18 | v61.43,80 v55.71,80 | v50.32,80.96 v37.94,80.96 | v42.51,98.1 v32.54,98.1
  Bottom 0.356: 51.91,100.33 51.91,99.69 IC1.52
  Bottom 0.406: 51.91,99.06 | 51.91,97.47 51.91,99.06 | 52.54,97.47 51.91,97.47 | 52.54,97.47 54.45,97.47 57.94,93.97 57.94,90.16 60.48,87.62 60.48,84.45 61.43,83.5 IC2.20 64.61,80.64 | 51.91,99.06 51.91,99.69 | 51.27,97.47 C15.1 48.09,96.83 47.46,96.2 43.02,96.2 42.51,96.71 v42.51,98.1 IC1.64 42.51,103.31 45.66,106.46 IC1.21 45.66,119.48 46.19,120.01 v46.82,120.01 | 51.91,97.47 51.27,97.47 | 51.27,97.47 51.91,98.1 52.54,97.47 | LED5.A LED4.A LED3.A 90.64,122.87 | 90.64,122.87 90.96,122.87 91.91,123.82 91.91,127.63 90.32,129.22 68.1,129.22 63.97,125.09 55.71,125.09 54.45,123.82 54.45,122.87 52.54,120.96 v52.54,120.01 | 65.24,80 C14.1 66.51,73.66 67.14,73.02 73.81,73.02 75.72,71.12 75.72,67.62 77.3,66.03 IC6.IN | 65.24,80 64.61,80 | 64.61,80 64.61,80.64 | JP1.2 18.88,118.1 16.34,120.65 11.27,120.65 8.73,118.1 JP2.2 6.82,116.2 4.92,114.3 4.92,111.75 5.55,111.12 | 9.93,101.59 9.93,100.4 10.73,99.59 IC4.18 10.73,93.34 | 9.93,101.59 IC4.6 9.93,105.47 7.46,107.94 7.46,109.22 5.55,111.12 | IC4.4 8.33,102 8.73,101.59 9.36,101.59 | 9.93,101.59 9.36,101.59 | 9.36,101.59 10,102.23 | 9.36,101.59 10,100.96 | 10.73,93.34 10.73,93.25 11.27,92.71 11.27,87.62 R15.2 15.71,80 16.34,79.37 25.87,79.37 26.5,80 26.5,80.64 | IC7.14 27.77,81.91 27.14,81.28 | 25.87,81.28 26.5,81.28 | 26.5,81.28 27.14,81.28 | 25.87,81.28 25.23,81.91 25.23,83.18 | 25.23,83.18 C18.1 | 39.84,81.91 39.84,83.18 | 39.84,83.18 C17.1 | 39.84,81.91 40.48,81.28 41.74,81.28 42.38,81.91 IC8.14 | v25.87,83.18 25.23,83.18 | 39.84,83.18 v40.48,83.18 | 50.95,79.05 DEBUG.3 | 50.95,79.05 51.91,80 v55.71,80 | 64.61,80 63.97,80 | 63.97,80 v61.43,80 | 26.5,81.28 26.5,80.64
  Bottom 0.406: 25.87,81.28 26.5,80.64 | 26.5,80.64 27.14,81.28 | IC3.30 95.4,110.17 96.99,111.75 96.99,113.66 95.72,114.93 94.77,114.93 IC3.32 94.45,117.79 C13.1 93.5,120.01 90.64,122.87 | QG1.14 1.74,129.53 1.1,128.9 1.1,113.03 3.01,111.12 5.55,111.12 | 50.95,79.05 50.95,80.32 v50.32,80.96 | v37.94,80.96 38.89,81.91 39.84,81.91 | R17.1 30,100.64 v32.54,98.1 | 64.61,80.64 63.97,80 | 65.24,80 64.61,80.64 | C9.2 10.73,93.34
  Bottom 0.61: 81.11,66.03 POWER_ON_RELAIS.2 81.11,44.76 78.26,41.91 60.48,41.91 59.21,40.64 59.21,32.06 v56.67,29.52 | 81.11,66.03 89.69,66.03 C11.+ | 81.11,66.03 IC6.IN
WR
  Bottom 0.406: IC3.29 92.23,107.63 82.07,117.79 77.12,117.79 75.72,116.38 75.72,114.14 74.92,113.34 59.68,113.34 58.86,114.17 IC1.33

### Text on the board
Bottom: +5V | GND | POWER | mikroPAD (c)2008 DB,PW,PFBM | V 1.0 Rev. 2
tPlace: Speaker | DBT03 | Test-SW | DBT03 | DBT03 | RELAIS S2-5V | ETHERNET | CONN. | TERMINAL | DBT03 | 0569564-1 | Note: All parts labled with DBT03 can be found on the old | modem pcb.
tNames: 628128 | & Dirk Broßwick @ 2008 | Designed by Peter Wiedron